# EAGLE design VU-Meter (EAGLE 9.3.0)
CNAME: AVR based VU Meter; CREVISION: 1.0; DESIGNER: Heol FIEF

## Sheet 1 of 4: MCU
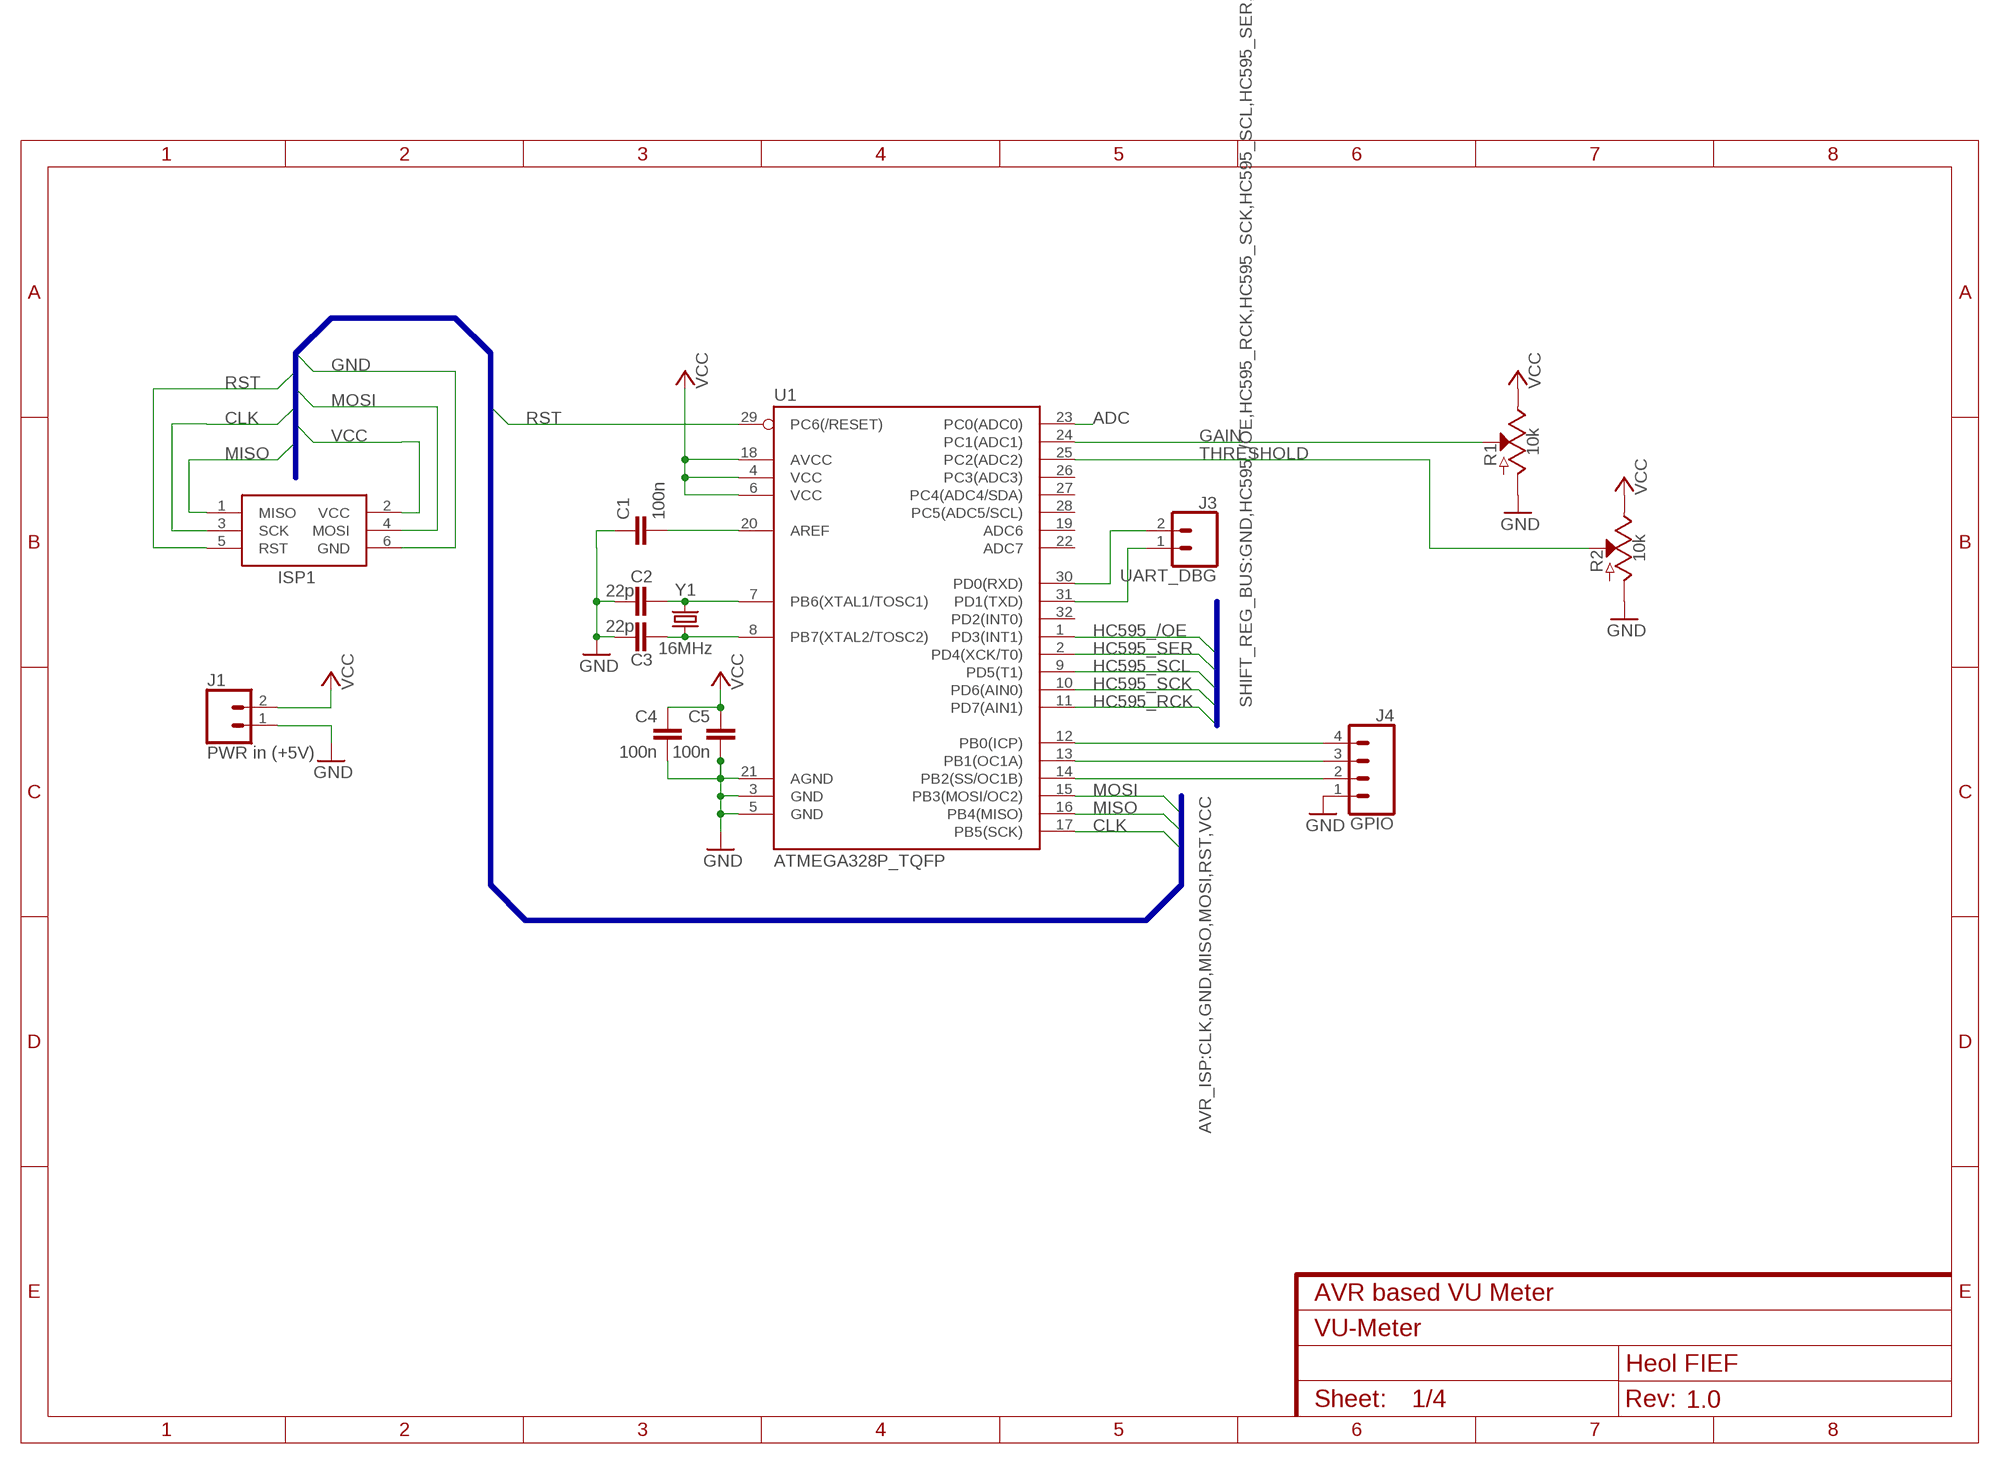
[diagram p0: schematic, sheet 1]

### Parts
C1  100n  C-EUC0805  [C0805]
C2  22p  C-EUC0805  [C0805]
C3  22p  C-EUC0805  [C0805]
C4  100n  C-EUC0805  [C0805]
C5  100n  C-EUC0805  [C0805]
ISP1  AVRISP-6  [AVRISP]
J1  PWR in (+5V)  CONN_02  [1X02]
J3  UART_DBG  CONN_02  [1X02]
J4  GPIO  CONN_04  [1X04]
R1  10k  POT_OFFBOARD  [1X03]
R2  10k  POT_OFFBOARD  [1X03]
U1  ATMEGA328P_TQFP  [TQFP32-08]
Y1  16MHz  CRYSTALSMD-3.2X2.5  [CRYSTAL-SMD-3.2X2.5MM]

### Nets
ADC: U1.23(PC0(ADC0)) ; also sheet 2
CLK: ISP1.3(SCK) U1.17(PB5(SCK))
GAIN: R1.2(S) U1.24(PC1(ADC1))
GND [power]: C1.1 C2.1 C3.1 C4.2 C5.2 ISP1.6(GND) J1.1 J4.1 R1.3(A) R2.3(A) U1.3(GND) U1.5(GND) U1.21(AGND) ; also sheet 2,3,4
HC595_/OE: U1.1(PD3(INT1)) ; also sheet 3
HC595_RCK: U1.11(PD7(AIN1)) ; also sheet 3
HC595_SCK: U1.10(PD6(AIN0)) ; also sheet 3
HC595_SCL: U1.9(PD5(T1)) ; also sheet 3
HC595_SER: U1.2(PD4(XCK/T0)) ; also sheet 3
MISO: ISP1.1(MISO) U1.16(PB4(MISO))
MOSI: ISP1.4(MOSI) U1.15(PB3(MOSI/OC2))
N$10: C1.2 U1.20(AREF)
N$99: C2.2 U1.7(PB6(XTAL1/TOSC1)) Y1.3
N$100: C3.2 U1.8(PB7(XTAL2/TOSC2)) Y1.1
N$103: J3.2 U1.30(PD0(RXD))
N$104: J3.1 U1.31(PD1(TXD))
N$105: J4.4 U1.12(PB0(ICP))
N$106: J4.3 U1.13(PB1(OC1A))
N$107: J4.2 U1.14(PB2(SS/OC1B))
RST: ISP1.5(RST) U1.29(PC6(/RESET))
THRESHOLD: R2.2(S) U1.25(PC2(ADC2))
VCC [power]: C4.1 C5.1 ISP1.2(VCC) J1.2 R1.1(E) R2.1(E) U1.4(VCC) U1.6(VCC) U1.18(AVCC) ; also sheet 2,3
Unconnected: U1.19(ADC6) U1.22(ADC7) U1.26(PC3(ADC3)) U1.27(PC4(ADC4/SDA)) U1.28(PC5(ADC5/SCL)) U1.32(PD2(INT0))

### Buses
AVR_ISP:CLK,GND,MISO,MOSI,RST,VCC
SHIFT_REG_BUS:GND,HC595_/OE,HC595_RCK,HC595_SCK,HC595_SCL,HC595_SER,VCC

## Sheet 2 of 4: Analog
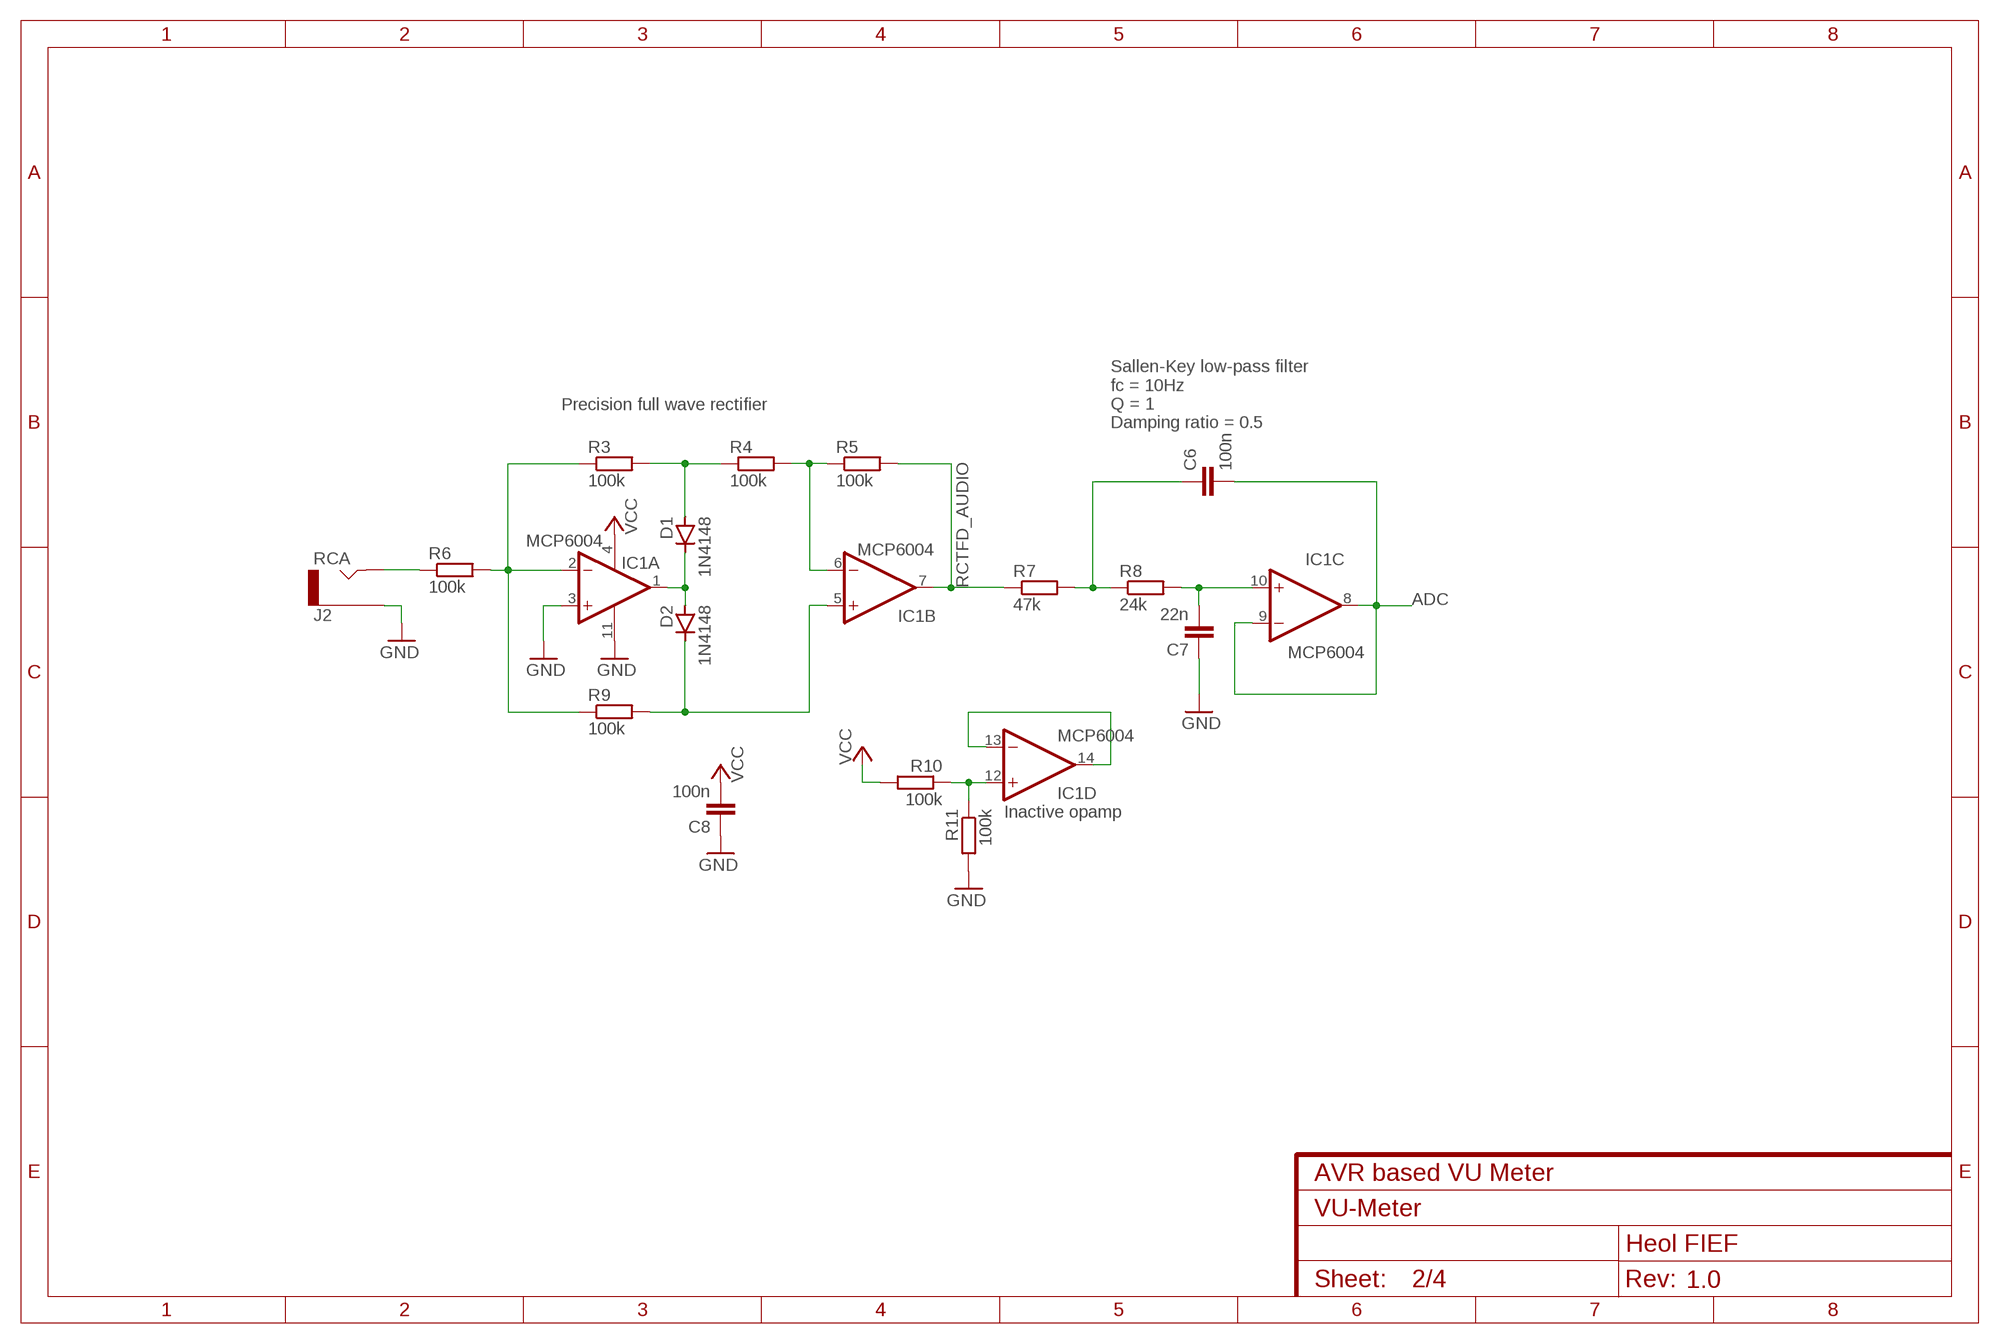
[diagram p1: schematic, sheet 2]

### Parts
C6  100n  C-EUC0805  [C0805]
C7  22n  C-EUC0805  [C0805]
C8  100n  C-EUC0805  [C0805]
D1  1N4148  D-SOD-80  [SOD80]
D2  1N4148  D-SOD-80  [SOD80]
IC1  MCP6004  QUAD_OPAMPD  [SO14]
J2  RCA  MONO_JACK_OFFBOARD  [1X02]
R3  100k  R-EU_R0805  [R0805]
R4  100k  R-EU_R0805  [R0805]
R5  100k  R-EU_R0805  [R0805]
R6  100k  R-EU_R0805  [R0805]
R7  47k  R-EU_R0805  [R0805]
R8  24k  R-EU_R0805  [R0805]
R9  100k  R-EU_R0805  [R0805]
R10  100k  R-EU_R0805  [R0805]
R11  100k  R-EU_R0805  [R0805]

### Nets
ADC: C6.2 IC1.8(C:OUT) IC1.9(C:-IN) ; also sheet 1
GND [power]: C7.1 C8.1 IC1.3(A:+IN) IC1.11(P:V-) J2.2(SLEEVE) R11.2 ; also sheet 1,3,4
N$1: IC1.2(A:-IN) R3.1 R6.2 R9.1
N$2: D2.1(C) IC1.5(B:+IN) R9.2
N$3: D1.1(C) D2.2(A) IC1.1(A:OUT)
N$4: D1.2(A) R3.2 R4.1
N$5: IC1.6(B:-IN) R4.2 R5.1
N$6: J2.1(TIP) R6.1
N$7: C6.1 R7.2 R8.1
N$8: C7.2 IC1.10(C:+IN) R8.2
N$101: IC1.13(D:-IN) IC1.14(D:OUT)
N$102: IC1.12(D:+IN) R10.1 R11.1
RCTFD_AUDIO: IC1.7(B:OUT) R5.2 R7.1
VCC [power]: C8.2 IC1.4(P:V+) R10.2 ; also sheet 1,3

### Notes on the sheet
- Precision full wave rectifier
- Sallen-Key low-pass filter
  fc = 10Hz
  Q = 1
  Damping ratio = 0.5
- Inactive opamp

## Sheet 3 of 4: Shift registers
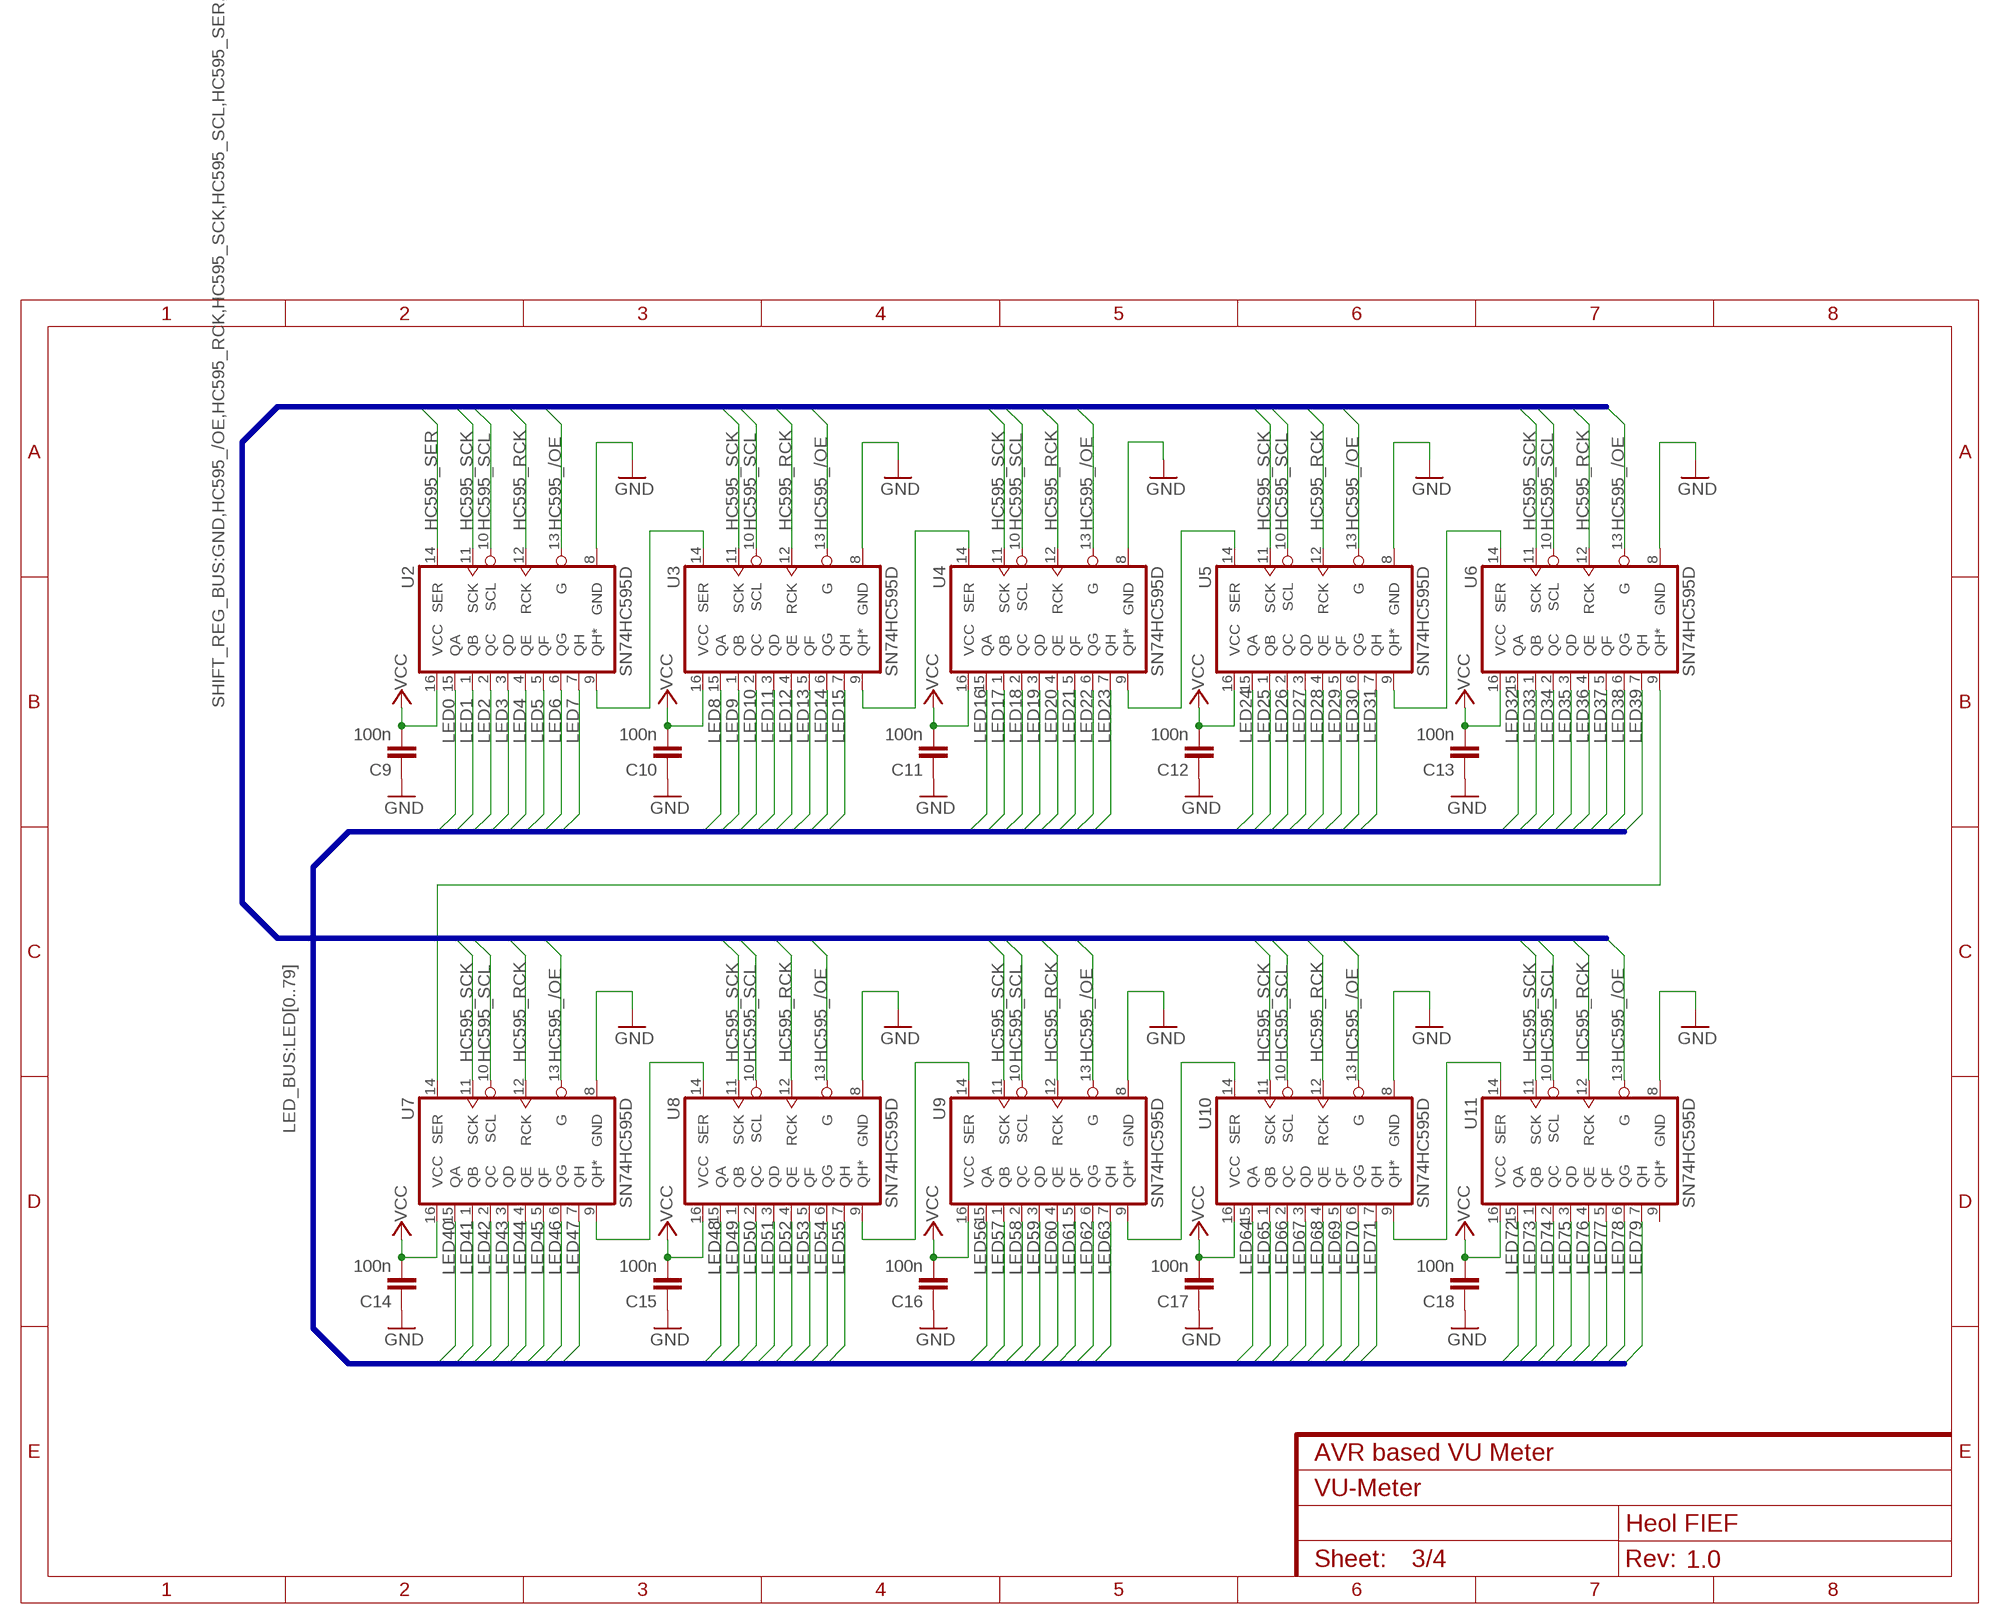
[diagram p2: schematic, sheet 3]

### Parts
C9  100n  C-EUC0805  [C0805]
C10  100n  C-EUC0805  [C0805]
C11  100n  C-EUC0805  [C0805]
C12  100n  C-EUC0805  [C0805]
C13  100n  C-EUC0805  [C0805]
C14  100n  C-EUC0805  [C0805]
C15  100n  C-EUC0805  [C0805]
C16  100n  C-EUC0805  [C0805]
C17  100n  C-EUC0805  [C0805]
C18  100n  C-EUC0805  [C0805]
U2  SN74HC595D  74HC595D  [SO16]
U3  SN74HC595D  74HC595D  [SO16]
U4  SN74HC595D  74HC595D  [SO16]
U5  SN74HC595D  74HC595D  [SO16]
U6  SN74HC595D  74HC595D  [SO16]
U7  SN74HC595D  74HC595D  [SO16]
U8  SN74HC595D  74HC595D  [SO16]
U9  SN74HC595D  74HC595D  [SO16]
U10  SN74HC595D  74HC595D  [SO16]
U11  SN74HC595D  74HC595D  [SO16]

### Nets
GND [power]: C9.1 C10.1 C11.1 C12.1 C13.1 C14.1 C15.1 C16.1 C17.1 C18.1 U2.8(GND) U3.8(GND) U4.8(GND) U5.8(GND) U6.8(GND) U7.8(GND) U8.8(GND) U9.8(GND) U10.8(GND) U11.8(GND) ; also sheet 1,2,4
HC595_/OE: U2.13(G) U3.13(G) U4.13(G) U5.13(G) U6.13(G) U7.13(G) U8.13(G) U9.13(G) U10.13(G) U11.13(G) ; also sheet 1
HC595_RCK: U2.12(RCK) U3.12(RCK) U4.12(RCK) U5.12(RCK) U6.12(RCK) U7.12(RCK) U8.12(RCK) U9.12(RCK) U10.12(RCK) U11.12(RCK) ; also sheet 1
HC595_SCK: U2.11(SCK) U3.11(SCK) U4.11(SCK) U5.11(SCK) U6.11(SCK) U7.11(SCK) U8.11(SCK) U9.11(SCK) U10.11(SCK) U11.11(SCK) ; also sheet 1
HC595_SCL: U2.10(SCL) U3.10(SCL) U4.10(SCL) U5.10(SCL) U6.10(SCL) U7.10(SCL) U8.10(SCL) U9.10(SCL) U10.10(SCL) U11.10(SCL) ; also sheet 1
HC595_SER: U2.14(SER) ; also sheet 1
LED0: U2.15(QA) ; also sheet 4
LED1: U2.1(QB) ; also sheet 4
LED2: U2.2(QC) ; also sheet 4
LED3: U2.3(QD) ; also sheet 4
LED4: U2.4(QE) ; also sheet 4
LED5: U2.5(QF) ; also sheet 4
LED6: U2.6(QG) ; also sheet 4
LED7: U2.7(QH) ; also sheet 4
LED8: U3.15(QA) ; also sheet 4
LED9: U3.1(QB) ; also sheet 4
LED10: U3.2(QC) ; also sheet 4
LED11: U3.3(QD) ; also sheet 4
LED12: U3.4(QE) ; also sheet 4
LED13: U3.5(QF) ; also sheet 4
LED14: U3.6(QG) ; also sheet 4
LED15: U3.7(QH) ; also sheet 4
LED16: U4.15(QA) ; also sheet 4
LED17: U4.1(QB) ; also sheet 4
LED18: U4.2(QC) ; also sheet 4
LED19: U4.3(QD) ; also sheet 4
LED20: U4.4(QE) ; also sheet 4
LED21: U4.5(QF) ; also sheet 4
LED22: U4.6(QG) ; also sheet 4
LED23: U4.7(QH) ; also sheet 4
LED24: U5.15(QA) ; also sheet 4
LED25: U5.1(QB) ; also sheet 4
LED26: U5.2(QC) ; also sheet 4
LED27: U5.3(QD) ; also sheet 4
LED28: U5.4(QE) ; also sheet 4
LED29: U5.5(QF) ; also sheet 4
LED30: U5.6(QG) ; also sheet 4
LED31: U5.7(QH) ; also sheet 4
LED32: U6.15(QA) ; also sheet 4
LED33: U6.1(QB) ; also sheet 4
LED34: U6.2(QC) ; also sheet 4
LED35: U6.3(QD) ; also sheet 4
LED36: U6.4(QE) ; also sheet 4
LED37: U6.5(QF) ; also sheet 4
LED38: U6.6(QG) ; also sheet 4
LED39: U6.7(QH) ; also sheet 4
LED40: U7.15(QA) ; also sheet 4
LED41: U7.1(QB) ; also sheet 4
LED42: U7.2(QC) ; also sheet 4
LED43: U7.3(QD) ; also sheet 4
LED44: U7.4(QE) ; also sheet 4
LED45: U7.5(QF) ; also sheet 4
LED46: U7.6(QG) ; also sheet 4
LED47: U7.7(QH) ; also sheet 4
LED48: U8.15(QA) ; also sheet 4
LED49: U8.1(QB) ; also sheet 4
LED50: U8.2(QC) ; also sheet 4
LED51: U8.3(QD) ; also sheet 4
LED52: U8.4(QE) ; also sheet 4
LED53: U8.5(QF) ; also sheet 4
LED54: U8.6(QG) ; also sheet 4
LED55: U8.7(QH) ; also sheet 4
LED56: U9.15(QA) ; also sheet 4
LED57: U9.1(QB) ; also sheet 4
LED58: U9.2(QC) ; also sheet 4
LED59: U9.3(QD) ; also sheet 4
LED60: U9.4(QE) ; also sheet 4
LED61: U9.5(QF) ; also sheet 4
LED62: U9.6(QG) ; also sheet 4
LED63: U9.7(QH) ; also sheet 4
LED64: U10.15(QA) ; also sheet 4
LED65: U10.1(QB) ; also sheet 4
LED66: U10.2(QC) ; also sheet 4
LED67: U10.3(QD) ; also sheet 4
LED68: U10.4(QE) ; also sheet 4
LED69: U10.5(QF) ; also sheet 4
LED70: U10.6(QG) ; also sheet 4
LED71: U10.7(QH) ; also sheet 4
LED72: U11.15(QA) ; also sheet 4
LED73: U11.1(QB) ; also sheet 4
LED74: U11.2(QC) ; also sheet 4
LED75: U11.3(QD) ; also sheet 4
LED76: U11.4(QE) ; also sheet 4
LED77: U11.5(QF) ; also sheet 4
LED78: U11.6(QG) ; also sheet 4
LED79: U11.7(QH) ; also sheet 4
N$18: U2.9(QH*) U3.14(SER)
N$19: U3.9(QH*) U4.14(SER)
N$20: U4.9(QH*) U5.14(SER)
N$21: U5.9(QH*) U6.14(SER)
N$94: U7.9(QH*) U8.14(SER)
N$95: U8.9(QH*) U9.14(SER)
N$96: U9.9(QH*) U10.14(SER)
N$97: U10.9(QH*) U11.14(SER)
N$98: U6.9(QH*) U7.14(SER)
VCC [power]: C9.2 C10.2 C11.2 C12.2 C13.2 C14.2 C15.2 C16.2 C17.2 C18.2 U2.16(VCC) U3.16(VCC) U4.16(VCC) U5.16(VCC) U6.16(VCC) U7.16(VCC) U8.16(VCC) U9.16(VCC) U10.16(VCC) U11.16(VCC) ; also sheet 1,2
Unconnected: U11.9(QH*)

### Buses
LED_BUS:LED[0..79]
SHIFT_REG_BUS:GND,HC595_/OE,HC595_RCK,HC595_SCK,HC595_SCL,HC595_SER,VCC

## Sheet 4 of 4: LED
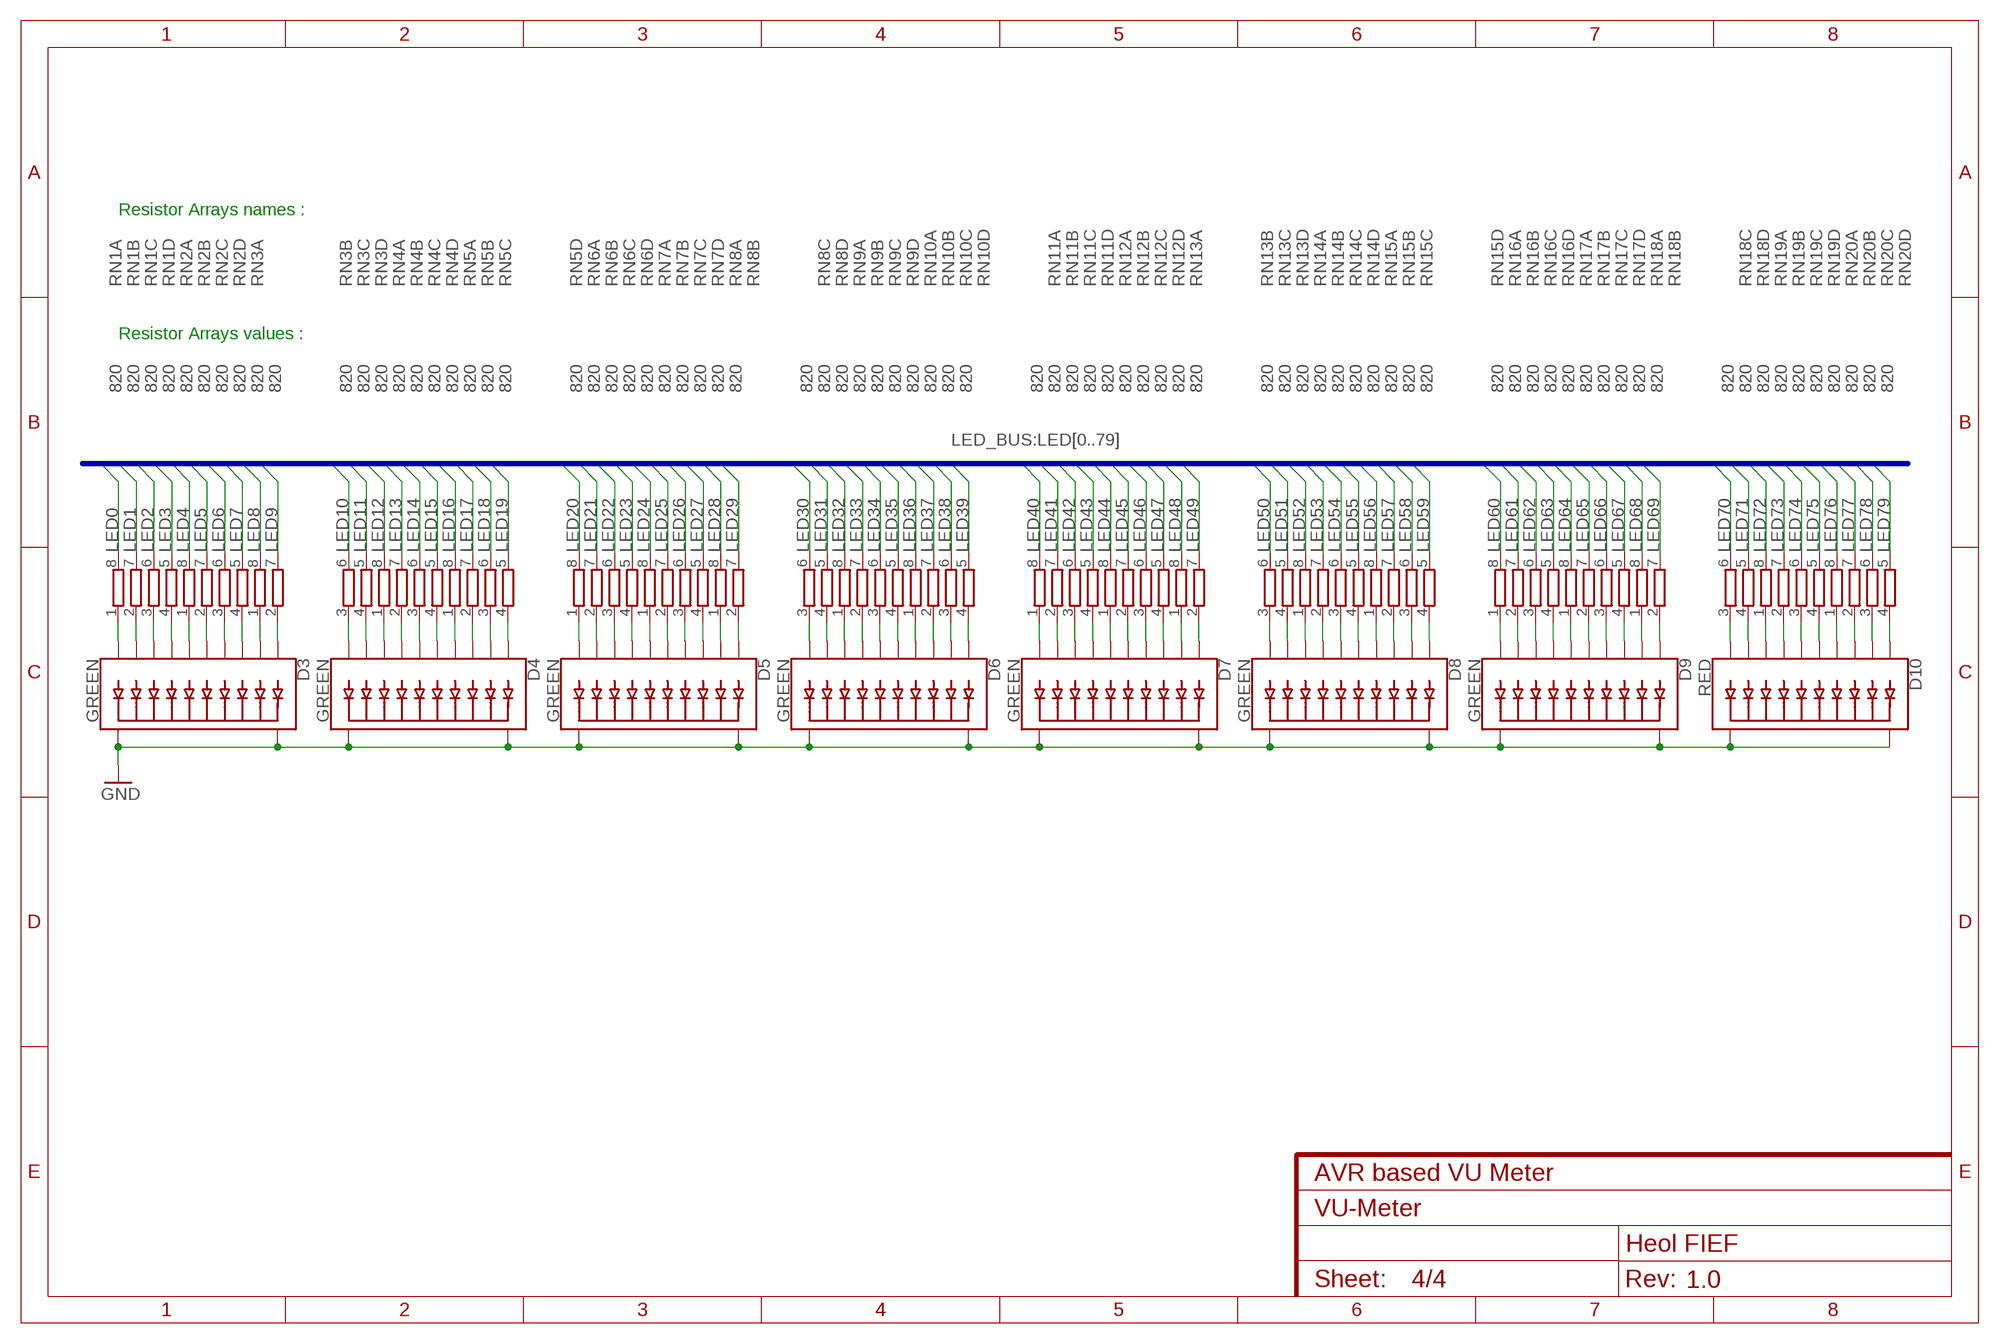
[diagram p3: schematic, sheet 4]

### Parts
D3  GREEN  LED_BARGRAPH_OFFBOARDLED_BARGRAPH_OFFBOARD  [LED_BARGRAPH_OFFBOARD_RIGHT_ANGLE]
D4  GREEN  LED_BARGRAPH_OFFBOARDLED_BARGRAPH_OFFBOARD  [LED_BARGRAPH_OFFBOARD_RIGHT_ANGLE]
D5  GREEN  LED_BARGRAPH_OFFBOARDLED_BARGRAPH_OFFBOARD  [LED_BARGRAPH_OFFBOARD_RIGHT_ANGLE]
D6  GREEN  LED_BARGRAPH_OFFBOARDLED_BARGRAPH_OFFBOARD  [LED_BARGRAPH_OFFBOARD_RIGHT_ANGLE]
D7  GREEN  LED_BARGRAPH_OFFBOARDLED_BARGRAPH_OFFBOARD  [LED_BARGRAPH_OFFBOARD_RIGHT_ANGLE]
D8  GREEN  LED_BARGRAPH_OFFBOARDLED_BARGRAPH_OFFBOARD  [LED_BARGRAPH_OFFBOARD_RIGHT_ANGLE]
D9  GREEN  LED_BARGRAPH_OFFBOARDLED_BARGRAPH_OFFBOARD  [LED_BARGRAPH_OFFBOARD_RIGHT_ANGLE]
D10  RED  LED_BARGRAPH_OFFBOARDLED_BARGRAPH_OFFBOARD  [LED_BARGRAPH_OFFBOARD_RIGHT_ANGLE]
RN1  820  4R-N0603-ARC  [0603-ARC]
RN2  820  4R-N0603-ARC  [0603-ARC]
RN3  820  4R-N0603-ARC  [0603-ARC]
RN4  820  4R-N0603-ARC  [0603-ARC]
RN5  820  4R-N0603-ARC  [0603-ARC]
RN6  820  4R-N0603-ARC  [0603-ARC]
RN7  820  4R-N0603-ARC  [0603-ARC]
RN8  820  4R-N0603-ARC  [0603-ARC]
RN9  820  4R-N0603-ARC  [0603-ARC]
RN10  820  4R-N0603-ARC  [0603-ARC]
RN11  820  4R-N0603-ARC  [0603-ARC]
RN12  820  4R-N0603-ARC  [0603-ARC]
RN13  820  4R-N0603-ARC  [0603-ARC]
RN14  820  4R-N0603-ARC  [0603-ARC]
RN15  820  4R-N0603-ARC  [0603-ARC]
RN16  820  4R-N0603-ARC  [0603-ARC]
RN17  820  4R-N0603-ARC  [0603-ARC]
RN18  820  4R-N0603-ARC  [0603-ARC]
RN19  820  4R-N0603-ARC  [0603-ARC]
RN20  820  4R-N0603-ARC  [0603-ARC]

### Nets
GND [power]: D3.P$11(C) D3.P$12(C1) D4.P$11(C) D4.P$12(C1) D5.P$11(C) D5.P$12(C1) D6.P$11(C) D6.P$12(C1) D7.P$11(C) D7.P$12(C1) D8.P$11(C) D8.P$12(C1) D9.P$11(C) D9.P$12(C1) D10.P$11(C) D10.P$12(C1) ; also sheet 1,2,3
LED0: RN1.8 ; also sheet 3
LED1: RN1.7 ; also sheet 3
LED2: RN1.6 ; also sheet 3
LED3: RN1.5 ; also sheet 3
LED4: RN2.8 ; also sheet 3
LED5: RN2.7 ; also sheet 3
LED6: RN2.6 ; also sheet 3
LED7: RN2.5 ; also sheet 3
LED8: RN3.8 ; also sheet 3
LED9: RN3.7 ; also sheet 3
LED10: RN3.6 ; also sheet 3
LED11: RN3.5 ; also sheet 3
LED12: RN4.8 ; also sheet 3
LED13: RN4.7 ; also sheet 3
LED14: RN4.6 ; also sheet 3
LED15: RN4.5 ; also sheet 3
LED16: RN5.8 ; also sheet 3
LED17: RN5.7 ; also sheet 3
LED18: RN5.6 ; also sheet 3
LED19: RN5.5 ; also sheet 3
LED20: RN6.8 ; also sheet 3
LED21: RN6.7 ; also sheet 3
LED22: RN6.6 ; also sheet 3
LED23: RN6.5 ; also sheet 3
LED24: RN7.8 ; also sheet 3
LED25: RN7.7 ; also sheet 3
LED26: RN7.6 ; also sheet 3
LED27: RN7.5 ; also sheet 3
LED28: RN8.8 ; also sheet 3
LED29: RN8.7 ; also sheet 3
LED30: RN8.6 ; also sheet 3
LED31: RN8.5 ; also sheet 3
LED32: RN9.8 ; also sheet 3
LED33: RN9.7 ; also sheet 3
LED34: RN9.6 ; also sheet 3
LED35: RN9.5 ; also sheet 3
LED36: RN10.8 ; also sheet 3
LED37: RN10.7 ; also sheet 3
LED38: RN10.6 ; also sheet 3
LED39: RN10.5 ; also sheet 3
LED40: RN11.8 ; also sheet 3
LED41: RN11.7 ; also sheet 3
LED42: RN11.6 ; also sheet 3
LED43: RN11.5 ; also sheet 3
LED44: RN12.8 ; also sheet 3
LED45: RN12.7 ; also sheet 3
LED46: RN12.6 ; also sheet 3
LED47: RN12.5 ; also sheet 3
LED48: RN13.8 ; also sheet 3
LED49: RN13.7 ; also sheet 3
LED50: RN13.6 ; also sheet 3
LED51: RN13.5 ; also sheet 3
LED52: RN14.8 ; also sheet 3
LED53: RN14.7 ; also sheet 3
LED54: RN14.6 ; also sheet 3
LED55: RN14.5 ; also sheet 3
LED56: RN15.8 ; also sheet 3
LED57: RN15.7 ; also sheet 3
LED58: RN15.6 ; also sheet 3
LED59: RN15.5 ; also sheet 3
LED60: RN16.8 ; also sheet 3
LED61: RN16.7 ; also sheet 3
LED62: RN16.6 ; also sheet 3
LED63: RN16.5 ; also sheet 3
LED64: RN17.8 ; also sheet 3
LED65: RN17.7 ; also sheet 3
LED66: RN17.6 ; also sheet 3
LED67: RN17.5 ; also sheet 3
LED68: RN18.8 ; also sheet 3
LED69: RN18.7 ; also sheet 3
LED70: RN18.6 ; also sheet 3
LED71: RN18.5 ; also sheet 3
LED72: RN19.8 ; also sheet 3
LED73: RN19.7 ; also sheet 3
LED74: RN19.6 ; also sheet 3
LED75: RN19.5 ; also sheet 3
LED76: RN20.8 ; also sheet 3
LED77: RN20.7 ; also sheet 3
LED78: RN20.6 ; also sheet 3
LED79: RN20.5 ; also sheet 3
N$9: D3.P$1(A9) RN1.1
N$11: D3.P$2(A8) RN1.2
N$12: D3.P$3(A7) RN1.3
N$13: D3.P$4(A6) RN1.4
N$14: D3.P$5(A5) RN2.1
N$15: D3.P$6(A4) RN2.2
N$16: D3.P$7(A3) RN2.3
N$17: D3.P$8(A2) RN2.4
N$22: D3.P$9(A1) RN3.1
N$23: D3.P$10(A) RN3.2
N$24: D4.P$1(A9) RN3.3
N$25: D4.P$2(A8) RN3.4
N$26: D4.P$3(A7) RN4.1
N$27: D4.P$4(A6) RN4.2
N$28: D4.P$5(A5) RN4.3
N$29: D4.P$6(A4) RN4.4
N$30: D4.P$7(A3) RN5.1
N$31: D4.P$8(A2) RN5.2
N$32: D4.P$9(A1) RN5.3
N$33: D4.P$10(A) RN5.4
N$34: D5.P$1(A9) RN6.1
N$35: D5.P$2(A8) RN6.2
N$36: D5.P$3(A7) RN6.3
N$37: D5.P$4(A6) RN6.4
N$38: D5.P$5(A5) RN7.1
N$39: D5.P$6(A4) RN7.2
N$40: D5.P$7(A3) RN7.3
N$41: D5.P$8(A2) RN7.4
N$42: D5.P$9(A1) RN8.1
N$43: D5.P$10(A) RN8.2
N$44: D6.P$1(A9) RN8.3
N$45: D6.P$2(A8) RN8.4
N$46: D6.P$3(A7) RN9.1
N$47: D6.P$4(A6) RN9.2
N$48: D6.P$5(A5) RN9.3
N$49: D6.P$6(A4) RN9.4
N$50: D6.P$7(A3) RN10.1
N$51: D6.P$8(A2) RN10.2
N$52: D6.P$9(A1) RN10.3
N$53: D6.P$10(A) RN10.4
N$54: D7.P$1(A9) RN11.1
N$55: D7.P$2(A8) RN11.2
N$56: D7.P$3(A7) RN11.3
N$57: D7.P$4(A6) RN11.4
N$58: D7.P$5(A5) RN12.1
N$59: D7.P$6(A4) RN12.2
N$60: D7.P$7(A3) RN12.3
N$61: D7.P$8(A2) RN12.4
N$62: D7.P$9(A1) RN13.1
N$63: D7.P$10(A) RN13.2
N$64: D8.P$1(A9) RN13.3
N$65: D8.P$2(A8) RN13.4
N$66: D8.P$3(A7) RN14.1
N$67: D8.P$4(A6) RN14.2
N$68: D8.P$5(A5) RN14.3
N$69: D8.P$6(A4) RN14.4
N$70: D8.P$7(A3) RN15.1
N$71: D8.P$8(A2) RN15.2
N$72: D8.P$9(A1) RN15.3
N$73: D8.P$10(A) RN15.4
N$74: D9.P$1(A9) RN16.1
N$75: D9.P$2(A8) RN16.2
N$76: D9.P$3(A7) RN16.3
N$77: D9.P$4(A6) RN16.4
N$78: D9.P$5(A5) RN17.1
N$79: D9.P$6(A4) RN17.2
N$80: D9.P$7(A3) RN17.3
N$81: D9.P$8(A2) RN17.4
N$82: D9.P$9(A1) RN18.1
N$83: D9.P$10(A) RN18.2
N$84: D10.P$1(A9) RN18.3
N$85: D10.P$2(A8) RN18.4
N$86: D10.P$3(A7) RN19.1
N$87: D10.P$4(A6) RN19.2
N$88: D10.P$5(A5) RN19.3
N$89: D10.P$6(A4) RN19.4
N$90: D10.P$7(A3) RN20.1
N$91: D10.P$8(A2) RN20.2
N$92: D10.P$9(A1) RN20.3
N$93: D10.P$10(A) RN20.4

### Buses
LED_BUS:LED[0..79]

### Notes on the sheet
- Resistor Arrays names :
- Resistor Arrays values :

## Library data of the parts
C1-C18 = rcl:C-EU: CAPACITOR, European symbol; SPICEPREFIX: C
D1 D2 = semicon-smd-ipc:D-: DIODE unfilled
D3-D10 = heol:LED_BARGRAPH_OFFBOARD: LED bargraph, right angle soldering
IC1 = adafruit:QUAD_OPAMP: OP AMP Standard quad package
ISP1 = adafruit:AVRISP: AVR ISP HEADER Standard 6 pin header for AVR programming
J1 J3 = SparkFun-Connectors:CONN_02: Multi connection point. Often used as Generic Header-pin footprint for 0.1 inch spaced/style header connections On any of the 0.1 inch spaced packages, you can populate with these: Break Away Headers - Straight <https://www.sparkfun.com/products/116> (PRT-00116) Break Away Male Headers - Right Angle <https://www.sparkfun.com/products/553> (PRT-00553) Female Headers <https://www.sparkfun.com/products/115> (PRT-00115) Break Away Headers - Machine Pin <https://www.sparkfun.com/products/117> (PRT-00117) Break Away Female Headers - Swiss Machine Pin <https://www.sparkfun.com/products/743> (PRT-00743) For SCREWTERMINALS and SPRING TERMINALS visit here: Screw Terimnals on SparkFun.com <https://www.sparkfun.com/search/results?term=Screw+Terminals> (5mm/3.5mm/2.54mm spacing) This device is also useful as a general connection point to wire up your design to another part of your project. Our various solder wires solder well into these plated through hole pads. Hook-Up Wire - Assortment (Stranded, 22 AWG) <https://www.sparkfun.com/products/11375> (PRT-11375) Hook-Up Wire - Assortment (Solid Core, 22 AWG) <https://www.sparkfun.com/products/11367> (PRT-11367) View the entire wire category on our website here <https://www.sparkfun.com/categories/141> Special notes: Molex polarized connector foot print use with: PRT-08233 with associated crimp pins and housings. 2.54_SCREWTERM for use with PRT-10571. 3.5mm Screw Terminal footprints for PRT-08084 5mm Screw Terminal footprints for use with PRT-08432
J2 = heol:MONO_JACK_OFFBOARD
J4 = SparkFun-Connectors:CONN_04: Multi connection point. Often used as Generic Header-pin footprint for 0.1 inch spaced/style header connections On any of the 0.1 inch spaced packages, you can populate with these: Break Away Headers - Straight <https://www.sparkfun.com/products/116> (PRT-00116) Break Away Male Headers - Right Angle <https://www.sparkfun.com/products/553> (PRT-00553) Female Headers <https://www.sparkfun.com/products/115> (PRT-00115) Break Away Headers - Machine Pin <https://www.sparkfun.com/products/117> (PRT-00117) Break Away Female Headers - Swiss Machine Pin <https://www.sparkfun.com/products/743> (PRT-00743) For SCREWTERMINALS and SPRING TERMINALS visit here: Screw Terimnals on SparkFun.com <https://www.sparkfun.com/search/results?term=Screw+Terminals> (5mm/3.5mm/2.54mm spacing) This device is also useful as a general connection point to wire up your design to another part of your project. Our various solder wires solder well into these plated through hole pads. Hook-Up Wire - Assortment (Stranded, 22 AWG) <https://www.sparkfun.com/products/11375> (PRT-11375) Hook-Up Wire - Assortment (Solid Core, 22 AWG) <https://www.sparkfun.com/products/11367> (PRT-11367) View the entire wire category on our website here <https://www.sparkfun.com/categories/141> Special notes: Molex polarized connector foot print use with SKU : PRT-08231 with associated crimp pins and housings. 1MM SMD Version SKU: PRT-10208; PROD_ID: CONN-09696
R1 R2 = heol:POT_OFFBOARD: Potentiometer with 3 pins connector for offboard wiring
R3-R11 = resistor:R-EU_: RESISTOR, European symbol
RN1-RN20 = resistor-dil:4R-N: Array Chip Resistor Source: RS Component / Phycomp; OC_FARNELL: unknown; OC_NEWARK: unknown
U1 = SparkFun-IC-Microcontroller:ATMEGA328P_TQFP: Popular 328P in QFP Storefront component: ATmega328 - TQFP <https://www.sparkfun.com/products/13448> (COM-13448) Datasheet <http://www.sparkfun.com/datasheets/Components/SMD/ATMega328.pdf> SparkFun Products SparkFun RedBoard - Programmed with Arduino <https://www.sparkfun.com/products/12757> (DEV-12757) Arduino Pro Mini 328 - 5V/16MHz <https://www.sparkfun.com/products/11113> (DEV-11113) Arduino Pro Mini 328 - 3.3V/8MHz <https://www.sparkfun.com/products/11114> (DEV-11114) SparkFun OpenLog <https://www.sparkfun.com/products/13712> (DEV-13712) SparkFun MicroView - OLED Arduino Module <https://www.sparkfun.com/products/12923> (DEV-12923) SparkFun Digital Sandbox <https://www.sparkfun.com/products/12651> (DEV-12651) SparkFun PicoBoard <https://www.sparkfun.com/products/11888> (WIG-11888) Arduino Fio <https://www.sparkfun.com/products/10116> (DEV-10116) LilyPad Arduino 328 Main Board <https://www.sparkfun.com/products/13342> (DEV-13342) SparkFun RedStick <https://www.sparkfun.com/products/13741> (DEV-13741) LilyPad MP3 <https://www.sparkfun.com/products/11013> (DEV-11013) LilyPad Arduino SimpleSnap <https://www.sparkfun.com/products/10941> (DEV-10941) SparkFun Stepoko <https://www.sparkfun.com/products/13899> (ROB-13899) SparkFun Geiger Counter <https://www.sparkfun.com/products/11345> (SEN-11345) SparkFun EL Sequencer <https://www.sparkfun.com/products/12781> (COM-12781) Arduino Pro 328 - 5V/16MHz <https://www.sparkfun.com/products/10915> (DEV-10915) CryptoCape <https://www.sparkfun.com/products/12773> (DEV-12773) SparkFun IR Thermometer Evaluation Board - MLX90614 <https://www.sparkfun.com/products/10740> (SEN-10740) SparkFun RedBot Mainboard <https://www.sparkfun.com/products/12097> (ROB-12097) Arduino Pro 328 - 3.3V/8MHz <https://www.sparkfun.com/products/10914> (DEV-10914) SparkFun Block for Intel® Edison - Arduino <https://www.sparkfun.com/products/13036> (DEV-13036) SparkFun Simon Says - Surface Mount Soldering Kit <https://www.sparkfun.com/products/10935> (KIT-10935) SparkFun 7-Segment Serial Display - Red <https://www.sparkfun.com/products/11441> (COM-11441) SparkFun 7-Segment Serial Display - White <https://www.sparkfun.com/products/11629> (COM-11629) SparkFun 7-Segment Serial Display - Yellow <https://www.sparkfun.com/products/11443> (COM-11443) SparkFun 7-Segment Serial Display - Kelly Green <https://www.sparkfun.com/products/11440> (COM-11440) SparkFun 7-Segment Serial Display - Blue <https://www.sparkfun.com/products/11442> (COM-11442) SparkFun OpenSegment Serial Display - 20mm (Blue) <https://www.sparkfun.com/products/11647> (COM-11647) SparkFun OpenSegment Serial Display - 20mm (Green) <https://www.sparkfun.com/products/11646> (COM-11646) SparkFun OpenSegment Serial Display - 20mm (White) <https://www.sparkfun.com/products/11648> (COM-11648) SparkFun OpenSegment Serial Display - 20mm (Red) <https://www.sparkfun.com/products/11644> (COM-11644) SparkFun OpenSegment Serial Display - 20mm (Yellow) <https://www.sparkfun.com/products/11645> (COM-11645) SparkFun OpenSegment Shield <https://www.sparkfun.com/products/13190> (DEV-13190); PROD_ID: IC-09069
U2-U11 = SparkFun-IC-Logic:74*595: 8-Bit Shift Register (Serial to Parallel) Datasheet <http://cdn.sparkfun.com/datasheets/BreakoutBoards/MM74HC595.pdf> SparkFun Products SparkFun Shift Register Breakout - 74HC595 <https://www.sparkfun.com/products/10680> (BOB-10680); PROD_ID: IC-07875
Y1 = SparkFun-Clocks:CRYSTAL: Crystals (Generic) These are passive quartz crystals, which can be used as a clock source for a microcontroller. Crystal's are two-terminal devices. They require external "load" capacitors to generate an oscillating signal.

## Net classes
0 default: width 0.178 mm
1 power: width 0.254 mm

## Board
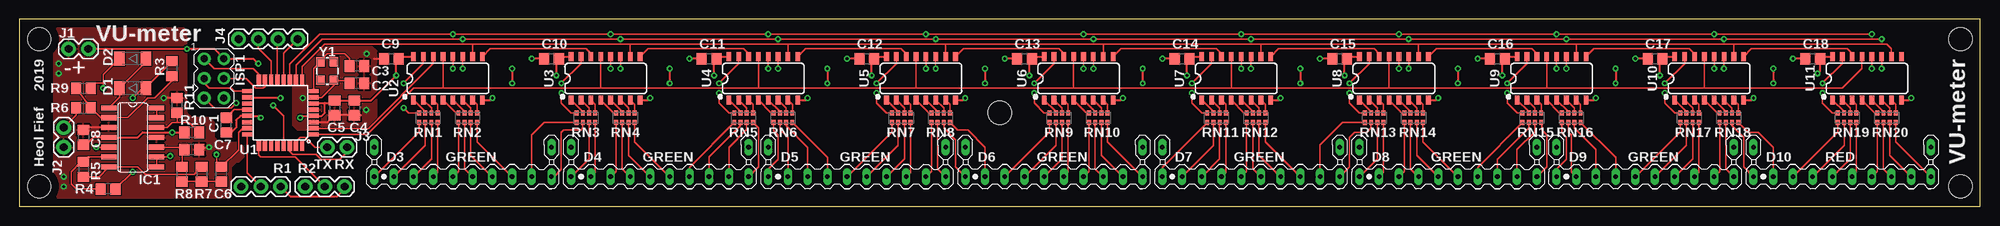
[diagram p4: board, top side]
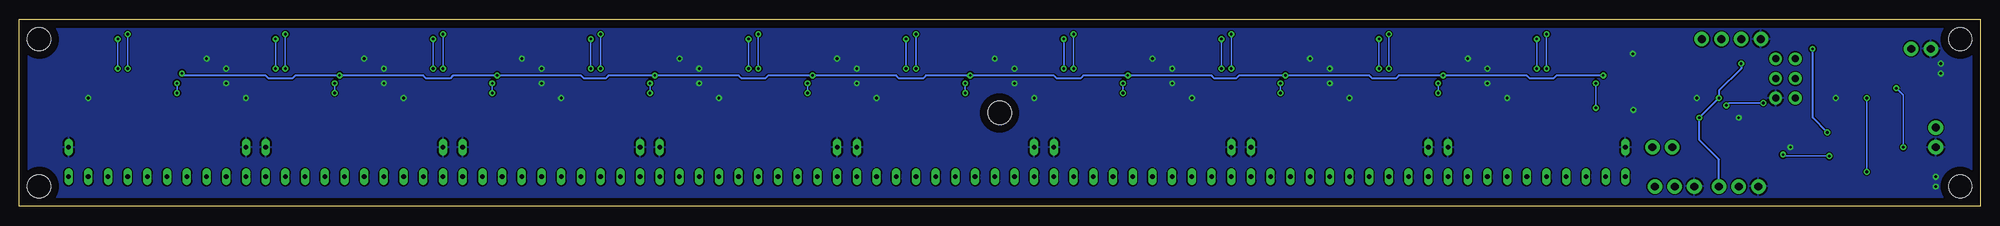
[diagram p5: board, bottom side, seen from below]

Size 252.72 x 24.13 mm. Coordinates in mm from the lower left corner, seen from the top.
Outline: 0,0 252.71,0 252.72,24.13 0.01,24.13 0,0
Copper layers (1*16): Top 0.035mm / dielectric 1.5mm / Bottom 0.035mm
Design rules "default": minimum track width 6mil, minimum drill 0.35mm, track to track 6mil, track to pad 6mil, pad to pad 6mil, via to via 6mil, smd to smd 6mil, copper to edge 40mil, drill to drill 6mil, minimum pad ring 10mil, minimum via ring 8mil, stop-mask expansion 4mil, vias tented up to drill 0mil, thermal gap 10mil
Holes 3 mm at 2.54,21.59 2.54,2.54 250.19,21.59 250.19,2.54 126.37,12.06

### Footprints (pad centres in the part's own frame; a part is rotated, then mirrored left to right if it is on the bottom)
C0805 = smd 1.3 x 1.5: 1 -0.95,0; 2 0.95,0
SOD80 = smd 1.4 x 1.8: 1 -1.7,0; 2 1.7,0
LED_BARGRAPH_OFFBOARD_RIGHT_ANGLE = drill 0.6 long: P$1 0,0; P$2 2.54,0; P$3 5.08,0; P$4 7.62,0; P$5 10.16,0; P$6 12.7,0; P$7 15.24,0; P$8 17.78,0; P$9 20.32,0; P$10 22.86,0; P$11 0,3.81; P$12 22.86,3.81
SO14 = smd 0.66 x 2.032: 1 -3.81,-3.073; 2 -2.54,-3.073; 3 -1.27,-3.073; 4 0,-3.073; 5 1.27,-3.073; 6 2.54,-3.073; 7 3.81,-3.073; 8 3.81,3.073; 9 2.54,3.073; 10 1.27,3.073; 11 0,3.073; 12 -1.27,3.073; 13 -2.54,3.073; 14 -3.81,3.073
AVRISP = drill 0.9 pad 1.626: 1 -1.27,2.54; 2 1.27,2.54; 3 -1.27,0; 4 1.27,0; 5 -1.27,-2.54; 6 1.27,-2.54
1X02 = drill 1.016 pad 1.88: 1 0,0; 2 2.54,0
1X04 = drill 1.016 pad 1.88: 1 0,0; 2 2.54,0; 3 5.08,0; 4 7.62,0
1X03 = drill 1.016 pad 1.88: 1 0,0; 2 2.54,0; 3 5.08,0
R0805 = smd 1.3 x 1.5: 1 -0.95,0; 2 0.95,0
0603-ARC = smd 0.5 x 0.65: 1 -1.2,-0.625; 2 -0.4,-0.625; 3 0.4,-0.625; 4 1.2,-0.625; 5 1.2,0.625; 6 0.4,0.625; 7 -0.4,0.625; 8 -1.2,0.625
TQFP32-08 = smd 1.27 x 0.559: 1 -4.293,2.8; 2 -4.293,2; 3 -4.293,1.2; 4 -4.293,0.4; 5 -4.293,-0.4; 6 -4.293,-1.2; 7 -4.293,-2; 8 -4.293,-2.8; 17 4.293,-2.8; 18 4.293,-2; 19 4.293,-1.2; 20 4.293,-0.4; 21 4.293,0.4; 22 4.293,1.2; 23 4.293,2; 24 4.293,2.8 | smd 0.559 x 1.27: 9 -2.8,-4.293; 10 -2,-4.293; 11 -1.2,-4.293; 12 -0.4,-4.293; 13 0.4,-4.293; 14 1.2,-4.293; 15 2,-4.293; 16 2.8,-4.293; 25 2.8,4.293; 26 2,4.293; 27 1.2,4.293; 28 0.4,4.293; 29 -0.4,4.293; 30 -1.2,4.293; 31 -2,4.293; 32 -2.8,4.293
SO16 = smd 0.6 x 1.2: 1 -4.445,-2.8; 2 -3.175,-2.8; 3 -1.905,-2.8; 4 -0.635,-2.8; 5 0.635,-2.8; 6 1.905,-2.8; 7 3.175,-2.8; 8 4.445,-2.8; 9 4.445,2.8; 10 3.175,2.8; 11 1.905,2.8; 12 0.635,2.8; 13 -0.635,2.8; 14 -1.905,2.8; 15 -3.175,2.8; 16 -4.445,2.8
CRYSTAL-SMD-3.2X2.5MM = smd 1.2 x 1.1: 1 -1.175,-0.875; 2 1.175,-0.875; 3 1.175,0.875; 4 -1.175,0.875

### Placement (x,y rotation side)
C1  26.67,10.48 90 top
C2  43.5,15.88 180 top
C3  43.5,18.1 180 top
C4  43.18,12.7 270 top
C5  40.64,12.7 270 top
C6  26.04,4.13 90 top
C7  22.22,7.3 180 top
C8  8.25,8.89 270 top
C9  47.94,19.05 0 top
C10  68.58,19.05 0 top
C11  88.9,19.05 0 top
C12  109.22,19.05 0 top
C13  129.54,19.05 0 top
C14  149.86,19.05 0 top
C15  170.18,19.05 0 top
C16  190.5,19.05 0 top
C17  210.82,19.05 0 top
C18  231.14,19.05 0 top
D1  14.61,15.24 0 top
D2  14.61,19.05 0 top
D3  45.72,3.81 0 top
D4  71.12,3.81 0 top
D5  96.52,3.81 0 top
D6  121.92,3.81 0 top
D7  147.32,3.81 0 top
D8  172.72,3.81 0 top
D9  198.12,3.81 0 top
D10  223.52,3.81 0 top
IC1  14.61,8.89 270 top
ISP1  25.08,16.51 0 top
J1  6.35,20.32 0 top
J2  5.71,10.16 270 top
J3  39.69,7.62 0 top
J4  28.26,21.59 0 top
R1  33.66,2.54 180 top
R2  41.91,2.54 180 top
R3  19.68,17.78 90 top
R4  11.43,2.22 180 top
R5  8.25,4.76 270 top
R6  8.25,12.7 0 top
R7  23.49,4.13 270 top
R8  20.95,4.13 90 top
R9  8.25,15.24 0 top
R10  22.22,9.53 180 top
R11  20.32,13.02 90 top
RN1  52.7,11.43 0 top
RN2  57.78,11.43 0 top
RN3  73.03,11.43 0 top
RN4  78.11,11.43 0 top
RN5  93.35,11.43 0 top
RN6  98.43,11.43 0 top
RN7  113.67,11.43 0 top
RN8  118.75,11.43 0 top
RN9  133.98,11.43 0 top
RN10  139.06,11.43 0 top
RN11  154.3,11.43 0 top
RN12  159.38,11.43 0 top
RN13  174.62,11.43 0 top
RN14  179.7,11.43 0 top
RN15  194.94,11.43 0 top
RN16  200.03,11.43 0 top
RN17  215.26,11.43 0 top
RN18  220.34,11.43 0 top
RN19  235.58,11.43 0 top
RN20  240.66,11.43 0 top
U1  33.66,12.06 180 top
U2  55.24,16.51 0 top
U3  75.57,16.51 0 top
U4  95.89,16.51 0 top
U5  116.21,16.51 0 top
U6  136.53,16.51 0 top
U7  156.84,16.51 0 top
U8  177.16,16.51 0 top
U9  197.48,16.51 0 top
U10  217.8,16.51 0 top
U11  238.12,16.51 0 top
Y1  39.69,17.46 270 top

### Tracks (layer width: path | path; a pad name or v marks a point on that pad's centre or on a via)
ADC  (via drill 0.35)
  Top 0.178: v25.4,6.67 25.4,5.4 25.72,5.08 C6.2 28.26,7.3 28.26,9.53 28.8,10.06 | IC1.8 IC1.9 19.3,6.35 v19.43,6.48 | 28.8,10.06 28.89,10.06 | 28.89,10.06 U1.23 | 28.8,10.06 28.89,10.06
  Bottom 0.178: v19.43,6.48 25.21,6.48 v25.4,6.67
CLK
  Top 0.178: U1.17 27.68,14.87 27.3,15.24 24.45,15.24 23.81,15.88 ISP1.3
GAIN
  Top 0.178: U1.24 29.36,4.29 R1.2
GND  (via drill 0.35)
  Top 0.254: IC1.3 8.57,10.16 C8.1 | v31.11,11.43 30.88,11.66 U1.21 28.49,11.66 27.94,11.11 27.94,10.16 27.31,9.53 C1.1 | U1.3 39.76,10.87 C5.2 C4.2 44.01,11.75 | C11.1 v86.36,19.05 | C10.1 v66.04,19.05 | C12.1 v106.68,19.05 | C13.1 v127,19.05 | C14.1 v147.32,19.05 | C15.1 v167.64,19.05 | C16.1 v187.96,19.05 | C17.1 v208.28,19.05 | C18.1 v228.6,19.05 | U10.8 223.26,13.71 v223.52,13.97 | U11.8 243.58,13.71 v243.84,13.97 | U9.8 202.94,13.71 v203.2,13.97 | U8.8 182.62,13.71 v182.88,13.97 | U7.8 162.3,13.71 v162.56,13.97 | U6.8 141.98,13.71 v142.24,13.97 | U5.8 121.66,13.71 v121.92,13.97 | U4.8 101.34,13.71 v101.6,13.97 | U3.8 81.02,13.71 v81.28,13.97 | U2.8 60.7,13.71 v60.96,13.97 | v63.5,17.78 v63.5,15.88 | v83.82,17.78 v83.82,15.88 | v104.14,17.78 v104.14,15.88 | v124.46,17.78 v124.46,15.88 | v144.78,17.78 v144.78,15.88 | v165.1,17.78 v165.1,15.88 | v185.42,17.78 v185.42,15.88 | v205.74,17.78 v205.74,15.88 | v226.06,17.78 v226.06,15.88 | R11.2 v18.61,13.97 | C7.1 23.49,7.62 v24.45,7.62 | 45.72,19.05 C9.1
  other vias: 44.7,12.45 44.77,19.68 5.08,18.41 5.08,17.14 5.71,3.81 5.71,2.54 36.51,13.97
  pour Bottom: 0.64,23.5 0.64,0.64 252.09,0.64 252.09,23.5
  pour Top: 27.3,5.08 27.3,1.59 26.67,0.95 5.08,0.95 4.45,1.59 4.45,22.54 5.08,23.18 20.95,23.18 21.59,22.54 21.59,12.06 22.22,11.43 24.45,11.43 25.08,10.79 25.08,8.89 25.72,8.26 28.26,8.26 28.89,7.62 28.89,6.35 28.26,5.71 27.94,5.71
  pour Top: 45.4,20.64 35.88,20.64 35.24,20 35.24,10.48 35.88,9.84 45.4,9.84 46.04,10.48 46.04,20
HC595_/OE
  Top 0.178: 95.25,15.24 74.93,15.24 | U3.13 74.93,16.51 74.93,15.88 74.93,15.24 | U4.13 95.25,15.88 95.25,15.24 | 74.93,15.24 54.61,15.24 | U2.13 54.61,16.51 54.61,15.88 54.61,15.24 | U1.1 44.82,9.27 45.09,9.53 50.8,15.24 54.61,15.24 | 95.25,15.24 115.57,15.24 | 115.57,15.24 135.89,15.24 | 135.89,15.24 156.21,15.24 | 156.21,15.24 176.53,15.24 | 176.53,15.24 196.85,15.24 | 196.85,15.24 217.17,15.24 | 217.17,15.24 234.95,15.24 237.49,17.78 U11.13 | U5.13 115.57,16.51 115.57,15.24 | U8.13 176.53,16.51 176.53,15.88 176.53,15.24 | U9.13 196.85,16.51 196.85,15.24 | U7.13 156.21,16.51 156.21,15.24 | U6.13 135.89,16.51 135.89,15.88 135.89,15.24 | U10.13 217.17,16.51 217.17,15.24
HC595_RCK  (via drill 0.35)
  Top 0.178: U4.12 v96.52,17.78 | U3.12 v76.2,17.78 | U2.12 v55.88,17.78 | v238.76,17.78 U11.12 | v238.76,22.23 v218.44,22.23 v198.12,22.23 v177.8,22.23 v157.48,22.23 v137.16,22.23 v116.84,22.23 v96.52,22.23 v76.2,22.23 v55.88,22.23 48.58,22.23 47.94,22.23 38.73,22.23 34.85,18.34 U1.11 | U5.12 v116.84,17.78 | U6.12 v137.16,17.78 | U10.12 v218.44,17.78 | U9.12 v198.12,17.78 | U8.12 v177.8,17.78 | U7.12 v157.48,17.78
  Bottom 0.178: v96.52,17.78 v96.52,22.23 | v76.2,17.78 v76.2,22.23 | v55.88,17.78 v55.88,22.23 | v238.76,22.23 v238.76,17.78 | v116.84,17.78 v116.84,22.23 | v137.16,17.78 v137.16,22.23 | v218.44,17.78 v218.44,22.23 | v198.12,17.78 v198.12,22.23 | v177.8,17.78 v177.8,22.23 | v157.48,17.78 v157.48,22.23
HC595_SCK  (via drill 0.35)
  Top 0.178: U4.11 v97.79,17.78 | U3.11 v77.47,17.78 | U2.11 v57.15,17.78 | v240.03,21.59 v219.71,21.59 v199.39,21.59 v179.07,21.59 v158.75,21.59 v138.43,21.59 v118.11,21.59 v97.79,21.59 v77.47,21.59 v57.15,21.59 48.26,21.59 47.62,21.59 39.05,21.59 35.66,18.19 U1.10 | U11.11 v240.03,17.78 | U5.11 v118.11,17.78 | U6.11 v138.43,17.78 | U10.11 v219.71,17.78 | U9.11 v199.39,17.78 | U8.11 v179.07,17.78 | U7.11 v158.75,17.78
  Bottom 0.178: v97.79,17.78 v97.79,21.59 | v77.47,17.78 v77.47,21.59 | v57.15,17.78 v57.15,21.59 | v240.03,17.78 v240.03,21.59 | v118.11,17.78 v118.11,21.59 | v138.43,17.78 v138.43,21.59 | v219.71,17.78 v219.71,21.59 | v199.39,17.78 v199.39,21.59 | v179.07,17.78 v179.07,21.59 | v158.75,17.78 v158.75,21.59
HC595_SCL
  Top 0.178: 99.06,20.95 78.74,20.95 | U4.10 99.06,20.95 | U3.10 78.74,20.95 | U2.10 58.42,20.95 | U1.9 36.45,18.04 39.37,20.95 46.99,20.95 47.94,20.95 58.42,20.95 | 99.06,20.95 119.38,20.95 | 119.38,20.95 139.7,20.95 | 139.7,20.95 160.02,20.95 | 160.02,20.95 180.34,20.95 | 180.34,20.95 200.66,20.95 | 200.66,20.95 220.98,20.95 | 220.98,20.95 240.66,20.95 241.3,20.32 U11.10 | U6.10 139.7,20.95 | U7.10 160.02,20.95 | U8.10 180.34,20.95 | U9.10 200.66,20.95 | U10.10 220.98,20.95 | U5.10 119.38,20.95 | 78.74,20.95 58.42,20.95
HC595_SER
  Top 0.178: U2.14 53.34,18.41 44.99,10.06 U1.2
LED0  (via drill 0.35)
  Top 0.178: RN1.8 50.17,12.05 v49.53,12.7 | v49.53,15.88 52.07,18.41 U2.15
  Bottom 0.178: v49.53,12.7 v49.53,15.88
LED1
  Top 0.178: RN1.7 52.3,12.21 U2.1
LED2
  Top 0.178: U2.2 53.1,12.68 RN1.6
LED3
  Top 0.178: U2.3 53.91,13.14 RN1.5
LED4
  Top 0.178: RN2.8 56.27,12.05 U2.4
LED5
  Top 0.178: RN2.7 57.38,12.21 U2.5
LED6
  Top 0.178: U2.6 58.19,12.68 RN2.6
LED7
  Top 0.178: U2.7 58.98,13.14 RN2.5
LED8  (via drill 0.35)
  Top 0.178: RN3.8 71.13,12.05 69.85,13.34 v69.85,14.61 | v69.85,15.88 72.39,18.41 U3.15
  Bottom 0.178: v69.85,14.61 v69.85,15.88
LED9
  Top 0.178: RN3.7 72.62,12.21 U3.1
LED10
  Top 0.178: U3.2 73.43,12.68 RN3.6
LED11
  Top 0.178: U3.3 74.23,13.14 RN3.5
LED12
  Top 0.178: RN4.8 76.59,12.05 U3.4
LED13
  Top 0.178: RN4.7 77.71,12.21 U3.5
LED14
  Top 0.178: U3.6 78.51,12.68 RN4.6
LED15
  Top 0.178: U3.7 79.31,13.14 RN4.5
LED16  (via drill 0.35)
  Top 0.178: RN5.8 91.45,12.05 90.17,13.34 v90.17,14.61 | v90.17,15.88 92.71,18.41 U4.15
  Bottom 0.178: v90.17,14.61 v90.17,15.88
LED17
  Top 0.178: RN5.7 92.95,12.21 U4.1
LED18
  Top 0.178: U4.2 93.75,12.68 RN5.6
LED19
  Top 0.178: U4.3 94.55,13.14 RN5.5
LED20
  Top 0.178: RN6.8 96.91,12.05 U4.4
LED21
  Top 0.178: RN6.7 98.03,12.21 U4.5
LED22
  Top 0.178: U4.6 98.83,12.68 RN6.6
LED23
  Top 0.178: U4.7 99.62,13.14 RN6.5
LED24  (via drill 0.35)
  Top 0.178: RN7.8 111.77,12.05 110.49,13.34 v110.49,14.61 | v110.49,15.88 113.03,18.41 U5.15
  Bottom 0.178: v110.49,14.61 v110.49,15.88
LED25
  Top 0.178: RN7.7 113.27,12.21 U5.1
LED26
  Top 0.178: U5.2 114.07,12.68 RN7.6
LED27
  Top 0.178: U5.3 114.87,13.14 RN7.5
LED28
  Top 0.178: RN8.8 117.23,12.05 U5.4
LED29
  Top 0.178: RN8.7 118.35,12.21 U5.5
LED30
  Top 0.178: U5.6 119.15,12.68 RN8.6
LED31
  Top 0.178: U5.7 119.95,13.14 RN8.5
LED32  (via drill 0.35)
  Top 0.178: RN9.8 132.09,12.05 130.81,13.34 v130.81,14.61 | v130.81,15.88 133.35,18.41 U6.15
  Bottom 0.178: v130.81,14.61 v130.81,15.88
LED33
  Top 0.178: RN9.7 133.58,12.21 U6.1
LED34
  Top 0.178: U6.2 134.38,12.68 RN9.6
LED35
  Top 0.178: U6.3 135.19,13.14 RN9.5
LED36
  Top 0.178: RN10.8 137.54,12.05 U6.4
LED37
  Top 0.178: RN10.7 138.66,12.21 U6.5
LED38
  Top 0.178: U6.6 139.47,12.68 RN10.6
LED39
  Top 0.178: U6.7 140.26,13.14 RN10.5
LED40  (via drill 0.35)
  Top 0.178: RN11.8 152.41,12.05 151.13,13.34 v151.13,14.61 | v151.13,15.88 153.67,18.41 U7.15
  Bottom 0.178: v151.13,14.61 v151.13,15.88
LED41
  Top 0.178: RN11.7 153.91,12.21 U7.1
LED42
  Top 0.178: U7.2 154.7,12.68 RN11.6
LED43
  Top 0.178: U7.3 155.5,13.14 RN11.5
LED44
  Top 0.178: RN12.8 157.86,12.05 U7.4
LED45
  Top 0.178: RN12.7 158.98,12.21 U7.5
LED46
  Top 0.178: U7.6 159.78,12.68 RN12.6
LED47
  Top 0.178: U7.7 160.58,13.14 RN12.5
LED48  (via drill 0.35)
  Top 0.178: RN13.8 172.73,12.05 171.45,13.34 v171.45,14.61 | v171.45,15.88 173.99,18.41 U8.15
  Bottom 0.178: v171.45,14.61 v171.45,15.88
LED49
  Top 0.178: RN13.7 174.22,12.21 U8.1
LED50
  Top 0.178: U8.2 175.03,12.68 RN13.6
LED51
  Top 0.178: U8.3 175.82,13.14 RN13.5
LED52
  Top 0.178: RN14.8 178.19,12.05 U8.4
LED53
  Top 0.178: RN14.7 179.3,12.21 U8.5
LED54
  Top 0.178: U8.6 180.1,12.68 RN14.6
LED55
  Top 0.178: U8.7 180.91,13.14 RN14.5
LED56  (via drill 0.35)
  Top 0.178: RN15.8 193.05,12.05 191.77,13.34 v191.77,14.61 | v191.77,15.88 194.31,18.41 U9.15
  Bottom 0.178: v191.77,14.61 v191.77,15.88
LED57
  Top 0.178: RN15.7 194.54,12.21 U9.1
LED58
  Top 0.178: U9.2 195.34,12.68 RN15.6
LED59
  Top 0.178: U9.3 196.14,13.14 RN15.5
LED60
  Top 0.178: RN16.8 198.5,12.05 U9.4
LED61
  Top 0.178: RN16.7 199.62,12.21 U9.5
LED62
  Top 0.178: U9.6 200.42,12.68 RN16.6
LED63
  Top 0.178: U9.7 201.22,13.14 RN16.5
LED64  (via drill 0.35)
  Top 0.178: RN17.8 213.37,12.05 212.09,13.34 v212.09,14.61 | v212.09,15.88 214.63,18.41 U10.15
  Bottom 0.178: v212.09,14.61 v212.09,15.88
LED65
  Top 0.178: RN17.7 214.86,12.21 U10.1
LED66
  Top 0.178: U10.2 215.66,12.68 RN17.6
LED67
  Top 0.178: U10.3 216.47,13.14 RN17.5
LED68
  Top 0.178: RN18.8 218.82,12.05 U10.4
LED69
  Top 0.178: RN18.7 219.94,12.21 U10.5
LED70
  Top 0.178: RN18.6 220.75,12.68 U10.6
LED71
  Top 0.178: RN18.5 221.54,13.14 U10.7
LED72  (via drill 0.35)
  Top 0.178: RN19.8 233.69,12.05 232.41,13.34 v232.41,14.61 | v232.41,15.88 234.95,18.41 U11.15
  Bottom 0.178: v232.41,15.88 v232.41,14.61
LED73
  Top 0.178: RN19.7 235.19,12.21 U11.1
LED74
  Top 0.178: U11.2 235.98,12.68 RN19.6
LED75
  Top 0.178: U11.3 236.78,13.14 RN19.5
LED76
  Top 0.178: RN20.8 239.14,12.05 U11.4
LED77
  Top 0.178: RN20.7 240.26,12.21 U11.5
LED78
  Top 0.178: U11.6 241.06,12.68 RN20.6
LED79
  Top 0.178: U11.7 241.86,13.14 RN20.5
MISO
  Top 0.178: ISP1.1 25.08,17.78 30.16,17.78 30.86,17.09 U1.16
MOSI
  Top 0.178: ISP1.4 29.21,16.51 30.48,15.24 31.43,15.24 31.65,15.46 U1.15
N$1
  Top 0.178: R6.2 | R6.2 10.47,11.43 IC1.2 13.97,11.43 16.51,13.97 17.46,13.97 19.68,16.19 R3.1 | R9.1 R6.2 | R6.2
N$2  (via drill 0.35)
  Top 0.178: D2.1 12.47,18.67 10.8,16.99 10.8,15.88 | IC1.5 v9.91,7.62 | v10.8,15.24 10.8,15.88 | R9.2 9.84,15.88 10.8,15.88
  Bottom 0.178: v10.8,15.24 9.91,14.35 v9.91,7.62
N$3
  Top 0.178: D2.2 16.3,18.64 D1.1 12.91,14.07 IC1.1
N$4  (via drill 0.35)
  Top 0.178: v14.61,13.97 15.88,15.24 D1.2 | 16.3,15.35 D1.2 | v14.61,4.45 R4.1 | D1.2 16.3,15.35 | 16.3,15.35 R3.2
  Bottom 0.178: v14.61,4.45 v14.61,13.97
N$5
  Top 0.178: IC1.6 8.89,6.35 R5.1 7.93,5.71 6.67,4.45 6.67,2.86 7.3,2.22 R4.2
N$6
  Top 0.178: J2.1 7.3,11.75 R6.1
N$7
  Top 0.178: R8.1 R7.2 C6.1
N$8
  Top 0.178: IC1.10 20.96,7.62 C7.2 20.95,6.98 R8.2
N$9
  Top 0.178: RN1.1 51.51,9.6 D3.P$1
N$10
  Top 0.178: U1.20 27.94,12.46 | 27.94,12.46 27.71,12.46 | C1.2 27.71,12.46 | 27.71,12.46 27.94,12.46
N$11
  Top 0.178: RN1.2 52.3,7.86 D3.P$2
N$12
  Top 0.178: RN1.3 53.1,6.12 D3.P$3
N$13
  Top 0.178: RN1.4 53.91,4.38 D3.P$4
N$14
  Top 0.178: RN2.1 56.59,4.51 D3.P$5
N$15
  Top 0.178: RN2.2 57.38,4.84 D3.P$6
N$16
  Top 0.178: RN2.3 58.19,6.58 D3.P$7
N$17
  Top 0.178: RN2.4 58.98,8.32 D3.P$8
N$18
  Top 0.178: U2.9 60.7,20.32 73.03,20.32 73.66,19.68 U3.14
N$19
  Top 0.178: U3.9 81.02,20.32 93.35,20.32 93.98,19.68 U4.14
N$20
  Top 0.178: U4.9 101.34,20.32 113.67,20.32 114.3,19.68 U5.14
N$21
  Top 0.178: U5.9 121.66,20.32 133.98,20.32 134.62,19.68 U6.14
N$22
  Top 0.178: RN3.1 67.64,10.8 66.04,9.21 D3.P$9
N$23
  Top 0.178: RN3.2 72.62,10.08 72.39,9.84 70.17,9.84 69.85,9.53 69.85,4.76 68.9,3.81 D3.P$10
N$24
  Top 0.178: D4.P$1 73.43,6.12 RN3.3
N$25
  Top 0.178: RN3.4 74.23,4.38 D4.P$2
N$26
  Top 0.178: RN4.1 76.91,4.51 D4.P$3
N$27
  Top 0.178: RN4.2 77.71,4.84 D4.P$4
N$28
  Top 0.178: RN4.3 78.51,6.58 D4.P$5
N$29
  Top 0.178: RN4.4 79.31,8.32 D4.P$6
N$30
  Top 0.178: RN5.1 86.36,5.02 D4.P$7
N$31
  Top 0.178: RN5.2 92.95,10.39 88.9,6.35 D4.P$8
N$32
  Top 0.178: D4.P$9 91.44,7.62 93.75,9.93 RN5.3
N$33
  Top 0.178: RN5.4 95.25,10.1 95.25,5.08 D4.P$10
N$34
  Top 0.178: D5.P$1 96.52,4.76 97.79,6.03 97.79,9.21 97.47,9.53 97.23,9.77 RN6.1
N$35
  Top 0.178: RN6.2 98.03,9.93 99.06,8.89 D5.P$2
N$36
  Top 0.178: RN6.3 98.83,10.39 101.6,7.62 D5.P$3
N$37
  Top 0.178: RN6.4 104.14,6.29 D5.P$4
N$38
  Top 0.178: D5.P$5 112.47,9.6 RN7.1
N$39
  Top 0.178: D5.P$6 113.27,7.86 RN7.2
N$40
  Top 0.178: D5.P$7 114.07,6.12 RN7.3
N$41
  Top 0.178: D5.P$8 114.87,4.38 RN7.4
N$42
  Top 0.178: D5.P$9 117.55,4.51 RN8.1
N$43
  Top 0.178: RN8.2 118.35,4.84 D5.P$10
N$44
  Top 0.178: RN8.3 119.15,10.08 120.65,8.57 120.65,5.08 D6.P$1
N$45
  Top 0.178: RN8.4 120.91,9.84 122.24,9.84 124.46,7.62 D6.P$2
N$46
  Top 0.178: D6.P$3 132.78,9.6 RN9.1
N$47
  Top 0.178: D6.P$4 133.58,7.86 RN9.2
N$48
  Top 0.178: D6.P$5 134.38,6.12 RN9.3
N$49
  Top 0.178: D6.P$6 135.19,4.38 RN9.4
N$50
  Top 0.178: D6.P$7 137.86,4.51 RN10.1
N$51
  Top 0.178: RN10.2 138.66,4.84 D6.P$8
N$52
  Top 0.178: RN10.3 139.47,6.58 D6.P$9
N$53
  Top 0.178: RN10.4 140.26,8.32 D6.P$10
N$54
  Top 0.178: D7.P$1 147.32,5.02 RN11.1
N$55
  Top 0.178: D7.P$2 153.91,7.86 RN11.2
N$56
  Top 0.178: D7.P$3 154.7,6.12 RN11.3
N$57
  Top 0.178: RN11.4 155.5,4.38 D7.P$4
N$58
  Top 0.178: RN12.1 158.19,4.51 D7.P$5
N$59
  Top 0.178: RN12.2 158.98,4.84 D7.P$6
N$60
  Top 0.178: RN12.3 159.78,6.58 D7.P$7
N$61
  Top 0.178: RN12.4 160.58,8.32 D7.P$8
N$62
  Top 0.178: RN13.1 170.51,10.8 167.64,7.94 D7.P$9
N$63
  Top 0.178: RN13.2 174.22,10.08 173.67,9.53 172.08,9.53 171.45,8.89 171.45,5.08 D7.P$10
N$64
  Top 0.178: D8.P$1 175.03,6.12 RN13.3
N$65
  Top 0.178: RN13.4 175.82,4.38 D8.P$2
N$66
  Top 0.178: RN14.1 178.5,4.51 D8.P$3
N$67
  Top 0.178: D8.P$4 179.3,4.84 RN14.2
N$68
  Top 0.178: RN14.3 180.1,6.58 D8.P$5
N$69
  Top 0.178: RN14.4 180.91,8.32 D8.P$6
N$70
  Top 0.178: RN15.1 187.96,5.02 D8.P$7
N$71
  Top 0.178: D8.P$8 190.5,6.03 194.54,10.08 RN15.2
N$72
  Top 0.178: D8.P$9 193.04,7.3 195.34,9.61 RN15.3
N$73
  Top 0.178: RN15.4 196.22,10.73 196.22,9.84 196.85,9.21 196.85,5.08 D8.P$10
N$74
  Top 0.178: D9.P$1 198.12,4.76 199.39,6.03 199.39,8.89 198.82,9.46 198.82,9.84 RN16.1
N$75
  Top 0.178: D9.P$2 200.03,4.45 200.03,9.21 199.62,9.61 RN16.2
N$76
  Top 0.178: RN16.3 200.42,10.08 203.2,7.3 D9.P$3
N$77
  Top 0.178: RN16.4 205.74,6.29 D9.P$4
N$78
  Top 0.178: D9.P$5 214.06,9.6 RN17.1
N$79
  Top 0.178: D9.P$6 214.86,7.86 RN17.2
N$80
  Top 0.178: D9.P$7 215.66,6.12 RN17.3
N$81
  Top 0.178: D9.P$8 216.47,4.38 RN17.4
N$82
  Top 0.178: D9.P$9 219.14,4.51 RN18.1
N$83
  Top 0.178: RN18.2 219.94,4.84 D9.P$10
N$84
  Top 0.178: RN18.3 220.75,10.39 222.25,8.89 222.25,5.08 D10.P$1
N$85
  Top 0.178: RN18.4 222.82,9.53 224.16,9.53 226.06,7.62 D10.P$2
N$86
  Top 0.178: D10.P$3 234.38,9.6 RN19.1
N$87
  Top 0.178: D10.P$4 235.19,7.86 RN19.2
N$88
  Top 0.178: D10.P$5 235.98,6.12 RN19.3
N$89
  Top 0.178: D10.P$6 236.78,4.38 RN19.4
N$90
  Top 0.178: D10.P$7 239.47,4.51 RN20.1
N$91
  Top 0.178: D10.P$8 240.26,4.84 RN20.2
N$92
  Top 0.178: D10.P$9 241.06,6.58 RN20.3
N$93
  Top 0.178: D10.P$10 241.86,8.32 RN20.4
N$94
  Top 0.178: U7.9 162.3,20.32 174.62,20.32 175.26,19.68 U8.14
N$95
  Top 0.178: U8.9 182.62,20.32 194.94,20.32 195.58,19.68 U9.14
N$96
  Top 0.178: U9.9 202.94,20.32 215.26,20.32 215.9,19.68 U10.14
N$97
  Top 0.178: U10.9 223.26,20.32 235.58,20.32 236.22,19.68 U11.14
N$98
  Top 0.178: U6.9 141.98,20.32 154.3,20.32 154.94,19.68 U7.14
N$99
  Top 0.178: U1.7 38.98,14.06 40.56,15.65 Y1.3 40.66,16.19 42.23,16.19 C2.2
N$100
  Top 0.178: U1.8 37.95,17.77 Y1.1 38.81,18.81 39.69,19.68 41.91,19.68 42.55,19.05 C3.2
N$101
  Top 0.178: IC1.14 IC1.13
N$102
  Top 0.178: IC1.12 19.05,10.16 19.37,10.48 | 19.37,10.48 19.68,10.79 | 19.68,10.79 19.37,10.48 | 20.32,10.79 21.9,10.79 R10.1 | 20.32,10.79 19.68,10.79 | R11.1 20.32,10.79
N$103
  Top 0.178: U1.30 34.85,7.05 35.23,6.68 38.24,6.68 38.88,6.03 41.27,6.03 42.23,6.99 J3.2
N$104
  Top 0.178: U1.31 35.66,8.35 36.2,8.89 36.83,8.89 38.1,7.62 J3.1
N$105
  Top 0.178: U1.12 34.05,19.77 J4.4
N$106
  Top 0.178: U1.13 33.26,21.51 J4.3
N$107
  Top 0.178: U1.14 32.45,18.73 30.8,20.39 J4.2
RCTFD_AUDIO
  Top 0.178: R5.2 10.26,3.81 IC1.7 15.24,5.08 16.19,4.13 16.83,4.13 22.54,4.13 R7.1
RST  (via drill 0.35)
  Top 0.178: v32.7,13.02 34.05,11.66 U1.29 | ISP1.5 25.08,12.7 27.3,12.7 v27.94,13.34
  Bottom 0.178: v27.94,13.34 32.38,13.34 v32.7,13.02
THRESHOLD
  Top 0.178: U1.25 30.86,6.61 31.11,6.35 35.56,6.35 R2.2
VCC  (via drill 0.35)
  Top 0.254: C8.2 8.57,7.94 9.53,8.89 IC1.4 15.24,8.89 15.88,9.53 v19.68,9.53 R10.2 | U1.6 38.02,13.34 39.37,13.34 | 39.37,13.34 40.32,13.34 C5.1 C4.1 45.33,13.65 v48.57,16.89 48.57,18.73 C9.2 48.84,19.31 U2.16 | 39.37,13.34 39.37,12.06 38.97,11.66 U1.4 36.43,11.66 v36.2,11.43 | R1.1 34.92,1.27 40.96,1.27 41.91,2.22 R2.1 | U1.18 33.56,14.06 v33.66,13.97 | U3.16 69.79,19.31 C10.2 69.22,18.73 v69.22,16.89 | U4.16 90.11,19.31 C11.2 89.54,18.73 v89.54,16.89 | U5.16 110.43,19.31 C12.2 109.86,18.73 v109.86,16.89 | U6.16 130.75,19.31 C13.2 130.18,18.73 v130.18,16.89 | U7.16 151.07,19.31 C14.2 150.5,18.73 v150.5,16.89 | U8.16 171.39,19.31 C15.2 170.81,18.73 v170.81,16.89 | U9.16 191.71,19.31 C16.2 191.13,18.73 v191.13,16.89 | U10.16 212.03,19.31 C17.2 211.45,18.73 v211.45,16.89 | U11.16 232.35,19.31 C18.2 232.09,17.46 v231.78,17.14 | J1.2 v21.59,20.32 25.08,20.32 ISP1.2 30.16,19.05 v30.8,18.41
  Bottom 0.254: R1.1 33.66,6.03 36.2,8.57 v36.2,11.43 v33.66,13.97 33.66,14.92 30.8,17.78 v30.8,18.41 | v48.57,16.89 53.98,16.89 54.61,16.89 54.99,16.51 58.04,16.51 58.42,16.89 v69.22,16.89 74.93,16.89 75.31,16.51 78.36,16.51 78.74,16.89 v89.54,16.89 95.5,16.89 95.89,16.51 98.68,16.51 99.06,16.89 v109.86,16.89 115.57,16.89 115.95,16.51 119,16.51 119.38,16.89 v130.18,16.89 135.89,16.89 136.27,16.51 139.32,16.51 139.7,16.89 v150.5,16.89 156.21,16.89 156.59,16.51 159.64,16.51 160.02,16.89 v170.81,16.89 176.78,16.89 177.16,16.51 179.96,16.51 180.34,16.89 v191.13,16.89 196.85,16.89 197.23,16.51 200.28,16.51 200.66,16.89 v211.45,16.89 217.17,16.89 217.55,16.51 220.6,16.51 220.98,16.89 231.52,16.89 v231.78,17.14 | v19.68,9.53 21.59,11.43 v21.59,20.32

### Text on the board
tPlace: VU-meter | -+ | Heol Fief 2019 | VU-meter
tNames: TX | RX